# EAGLE design ImageProc (EAGLE 6.5.0)
AUTHOR: Ryan Julian (ryanjulian@berkeley.edu); DESIGN_NAME: ImageProc 2.5; REVISION: C; YEAR: 2012

## Sheet 1 of 5: Power
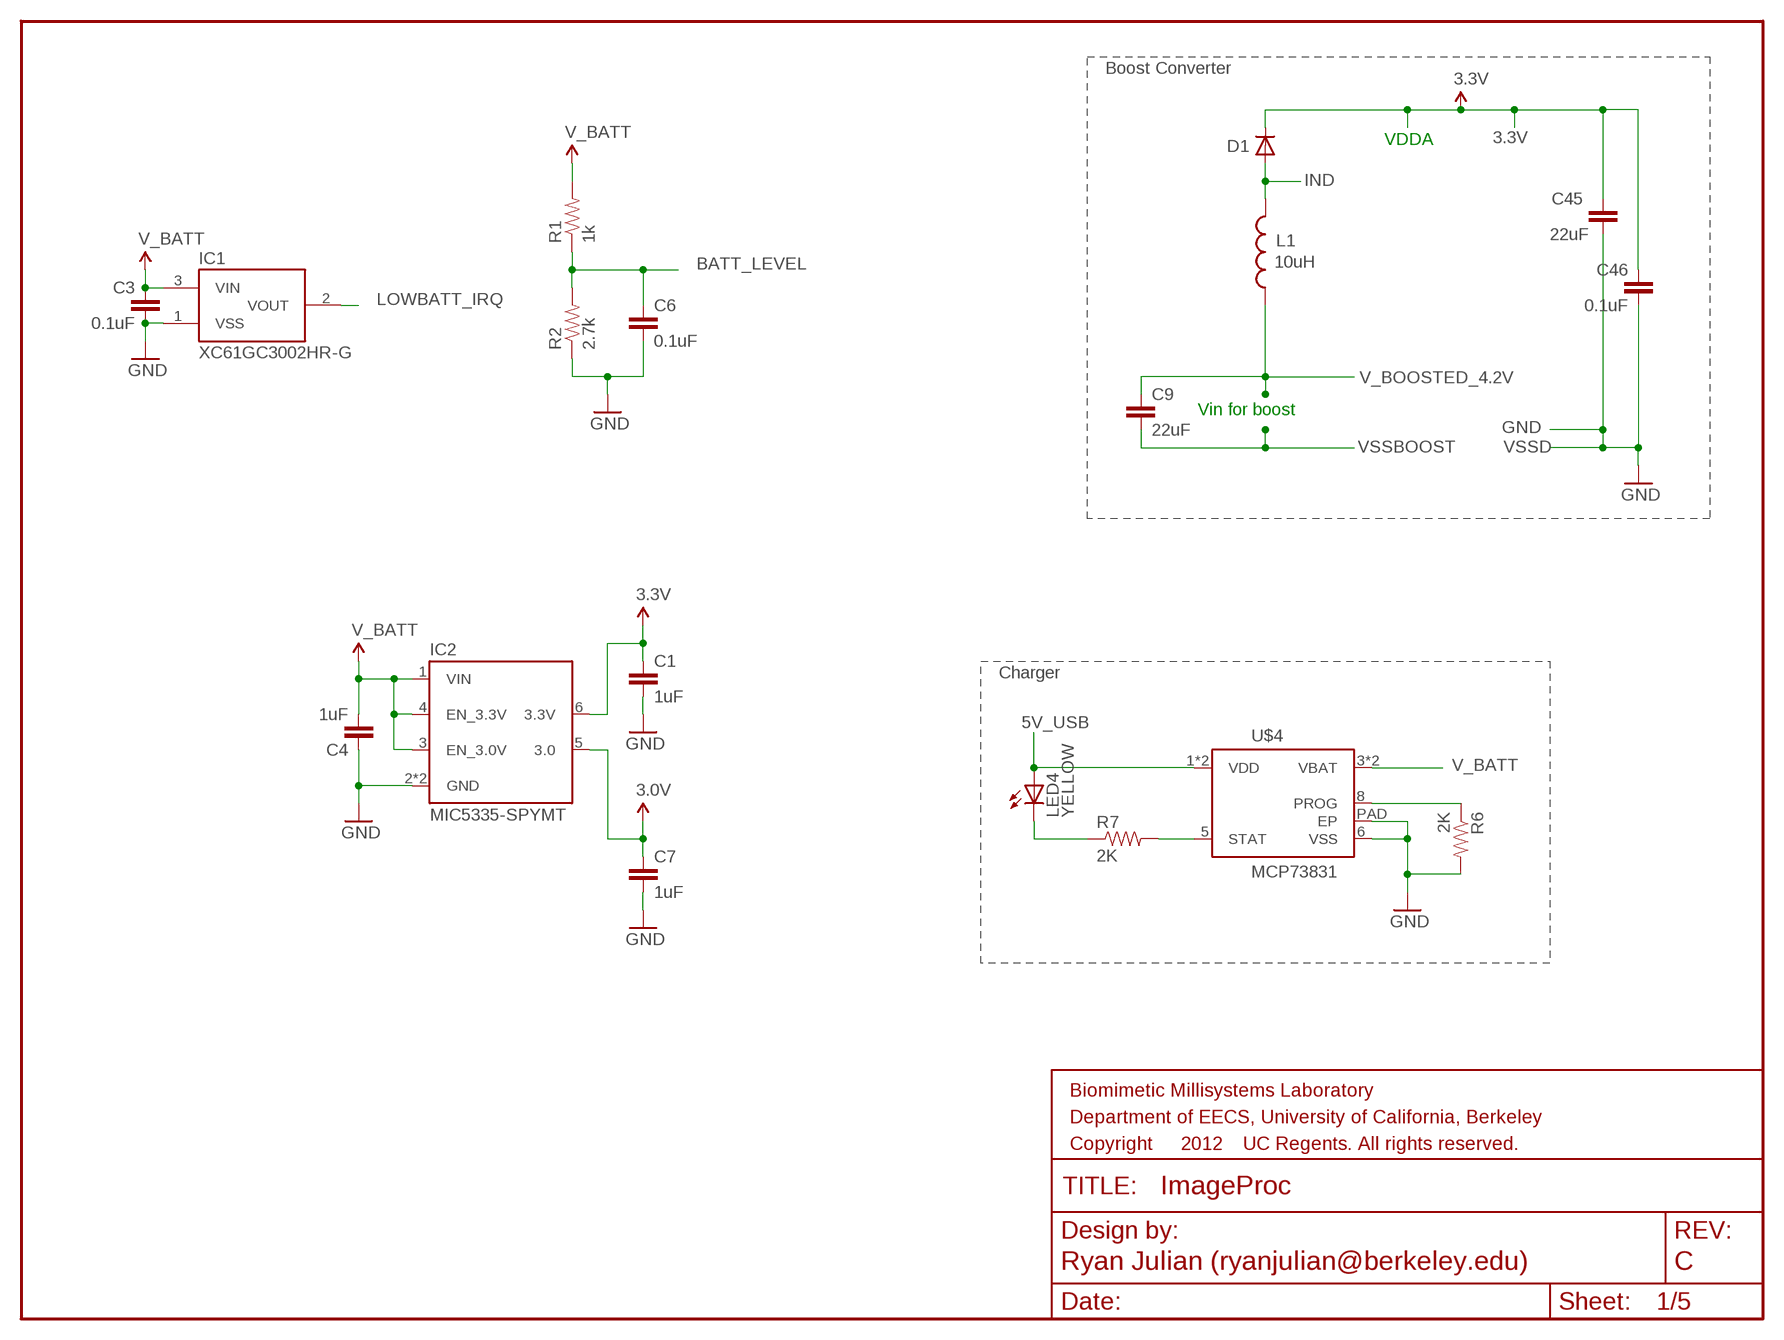
[diagram p0: schematic, sheet 1]
FRAME6 (FRAME-LETTER): SHEET_NAME: Power; YEAR: 2012

### Parts
C1  1uF  CAP0402-CAP  [0402-CAP]
C3  0.1uF  CAP0402-CAP  [0402-CAP]
C4  1uF  CAP0402-CAP  [0402-CAP]
C6  0.1uF  CAP0402-CAP  [0402-CAP]
C7  1uF  CAP0402-CAP  [0402-CAP]
C9  22uF  CAP0805  [0805]
C45  22uF  CAP0805  [0805]
C46  0.1uF  CAP0402-CAP  [0402-CAP]
D1  DIODE-SOD123  [SOD123]
IC1  XC61GC3002HR-G  [USP-3]
IC2  MIC5335-SPYMT  [MLF-6]
L1  10uH  SRN3015-100M  [INDUCTOR_SMD_3X3]
LED4  YELLOW  LED0603  [LED-0603]
R1  1k  RESISTOR0402-RES  [0402-RES]
R2  2.7k  RESISTOR0402-RES  [0402-RES]
R6  2K  RESISTOR0402-RES  [0402-RES]
R7  2K  RESISTOR0402-RES  [0402-RES]
U$4  MCP73831  [DFN-8]

### Nets
3.0V: C7.1 IC2.5(3.0)
3.3V: C1.1 C45.1 C46.1 D1.C IC2.6(3.3V) ; also sheet 2,3,4,5
5V_USB: LED4.A U$4.1(VDD) U$4.2(VDD) ; also sheet 5
BATT_LEVEL: C6.1 R1.1 R2.2 ; also sheet 2
GND: C1.2 C3.2 C4.1 C6.2 C7.2 C45.2 C46.2 IC1.1(VSS) IC2.2(GND) IC2.EPAD(GND) R2.1 R6.2 U$4.6(VSS) U$4.PAD(EP) ; also sheet 2,3,4,5
IND: D1.A L1.P$2 ; also sheet 2
LOWBATT_IRQ: IC1.2(VOUT) ; also sheet 2
N$5: R6.1 U$4.8(PROG)
N$11: LED4.C R7.1
N$21: R7.2 U$4.5(STAT)
V_BATT: C3.1 C4.2 IC1.3(VIN) IC2.1(VIN) IC2.3(EN_3.0V) IC2.4(EN_3.3V) R1.2 U$4.3(VBAT) U$4.4(VBAT) ; also sheet 4,5
V_BOOSTED_4.2V: C9.1 L1.P$1 ; also sheet 2
VSSBOOST: C9.2 ; also sheet 2

### Notes on the sheet
- Boost Converter
- VDDA
- Vin for boost
- VSSD
- Charger

## Sheet 2 of 5: Microcontroller
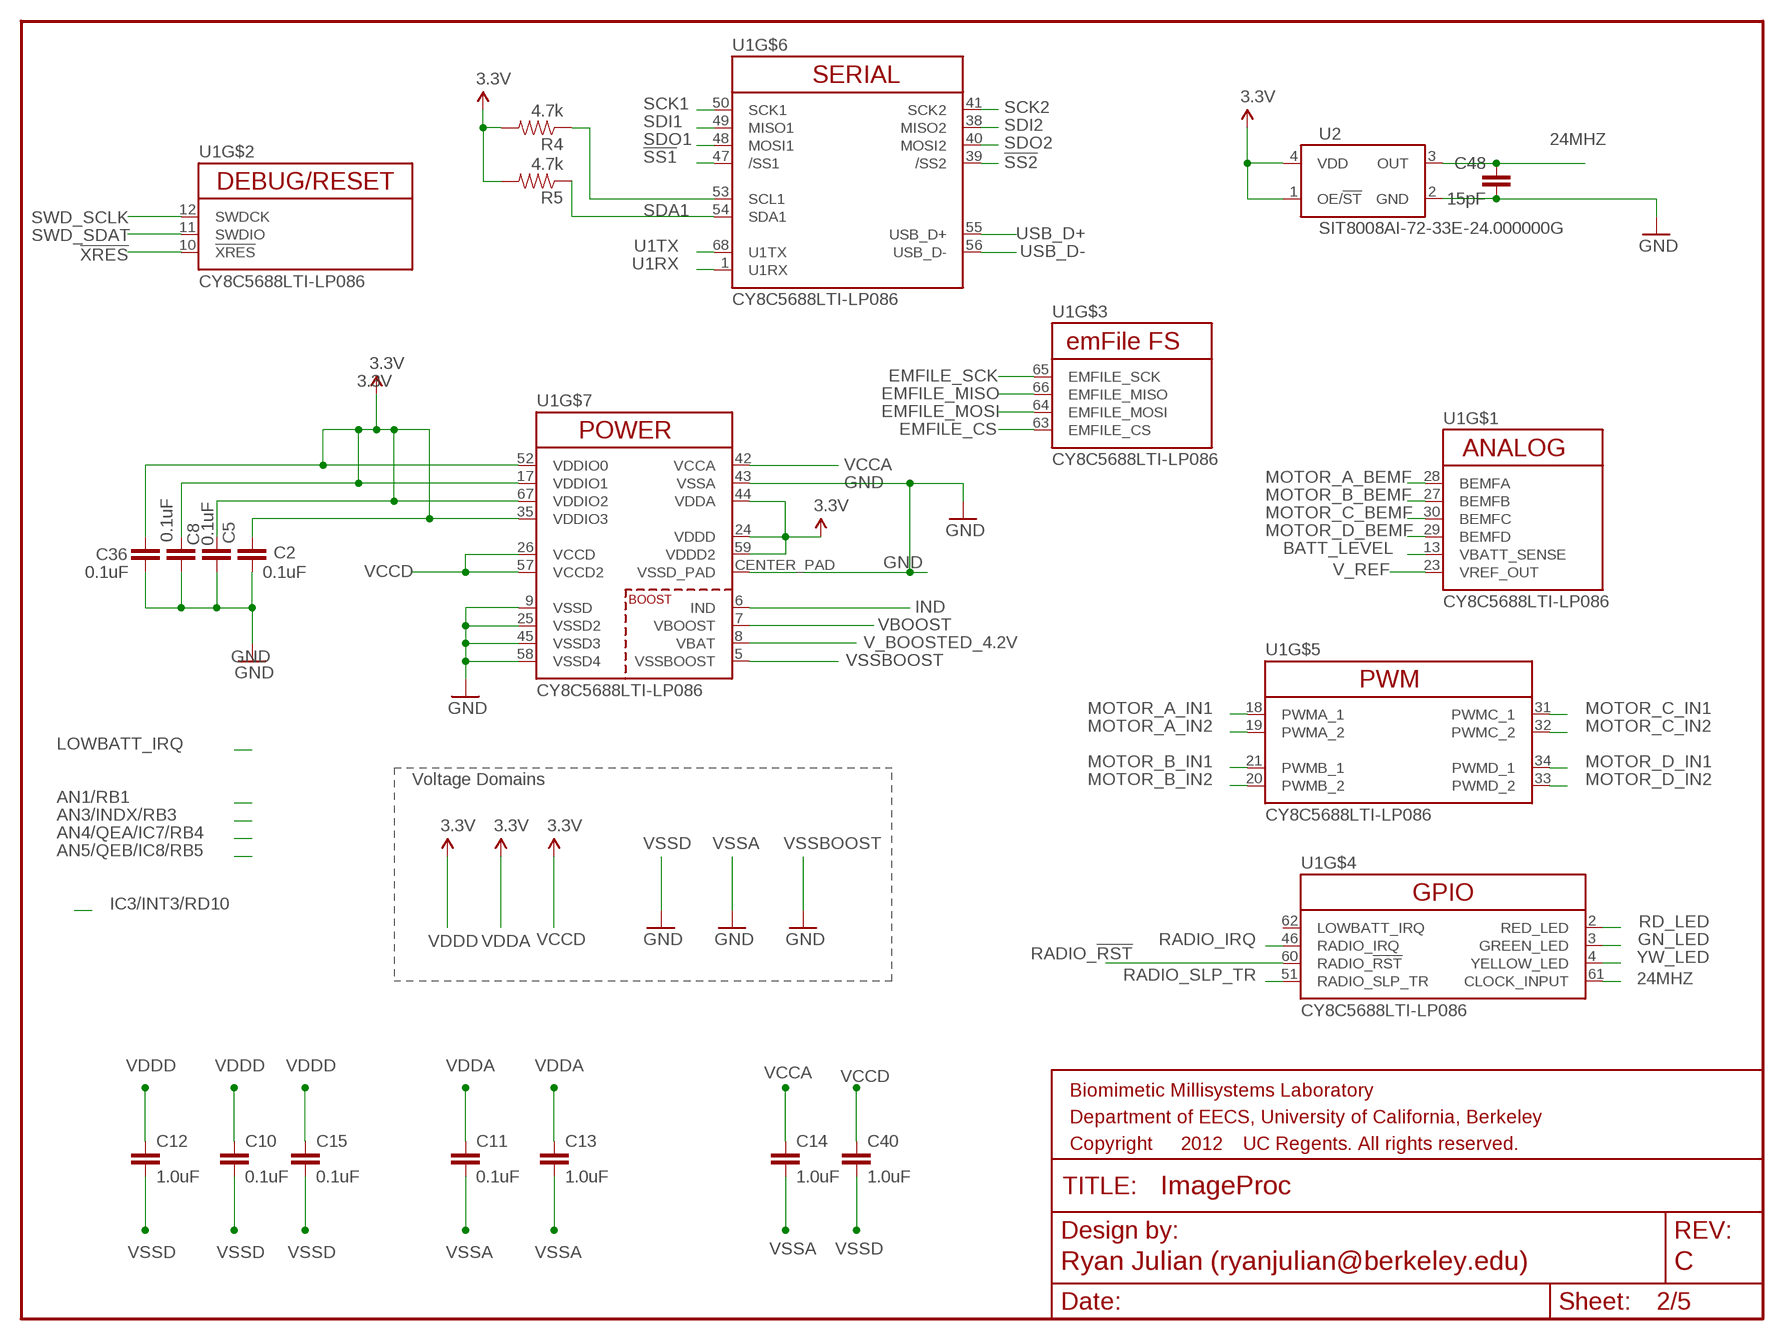
[diagram p1: schematic, sheet 2]
FRAME2 (FRAME-LETTER): SHEET_NAME: Microcontroller

### Parts
C2  0.1uF  CAP0402-CAP  [0402-CAP]
C5  0.1uF  CAP0402-CAP  [0402-CAP]
C8  0.1uF  CAP0402-CAP  [0402-CAP]
C10  0.1uF  CAP0402-CAP  [0402-CAP]
C11  0.1uF  CAP0402-CAP  [0402-CAP]
C12  1.0uF  CAP0402-CAP  [0402-CAP]
C13  1.0uF  CAP0402-CAP  [0402-CAP]
C14  1.0uF  CAP0402-CAP  [0402-CAP]
C15  0.1uF  CAP0402-CAP  [0402-CAP]
C36  0.1uF  CAP0402-CAP  [0402-CAP]
C40  1.0uF  CAP0402-CAP  [0402-CAP]
C48  15pF  CAP0402-CAP  [0402-CAP]
R4  4.7k  RESISTOR0402-RES  [0402-RES]
R5  4.7k  RESISTOR0402-RES  [0402-RES]
U1  CY8C5688LTI-LP086  [68QFN]
U2  SIT8008AI-72-33E-24.000000G  [4-SMD]

### Nets
3.3V: C2.1 C5.1 C8.1 C10.1 C11.1 C12.1 C13.1 C15.1 C36.1 R4.2 R5.2 U1.17(VDDIO1) U1.24(VDDD) U1.35(VDDIO3) U1.44(VDDA) U1.52(VDDIO0) U1.59(VDDD2) U1.67(VDDIO2) U2.1(OE/!ST) U2.4(VDD) ; also sheet 1,3,4,5
24MHZ: C48.1 U1.61(CLOCK_INPUT) U2.3(OUT)
!SS1: U1.47(/SS1) ; also sheet 3
!SS2: U1.39(/SS2) ; also sheet 5
!XRES: U1.10(!XRES) ; also sheet 5
BATT_LEVEL: U1.13(VBATT_SENSE) ; also sheet 1
EMFILE_CS: U1.63(EMFILE_CS) ; also sheet 5
EMFILE_MISO: U1.66(EMFILE_MISO) ; also sheet 5
EMFILE_MOSI: U1.64(EMFILE_MOSI) ; also sheet 5
EMFILE_SCK: U1.65(EMFILE_SCK) ; also sheet 5
GN_LED: U1.3(GREEN_LED) ; also sheet 5
GND: C2.2 C5.2 C8.2 C10.2 C11.2 C12.2 C14.2 C15.2 C36.2 C40.2 C48.2 U1.9(VSSD) U1.25(VSSD2) U1.43(VSSA) U1.45(VSSD3) U1.58(VSSD4) U1.CENTER_PAD(VSSD_PAD) U2.2(GND) ; also sheet 1,3,4,5
IND: U1.6(IND) ; also sheet 1
MOTOR_A_BEMF: U1.28(BEMFA) ; also sheet 4
MOTOR_A_IN1: U1.18(PWMA_1) ; also sheet 4
MOTOR_A_IN2: U1.19(PWMA_2) ; also sheet 4
MOTOR_B_BEMF: U1.27(BEMFB) ; also sheet 4
MOTOR_B_IN1: U1.21(PWMB_1) ; also sheet 4
MOTOR_B_IN2: U1.20(PWMB_2) ; also sheet 4
MOTOR_C_BEMF: U1.30(BEMFC) ; also sheet 4
MOTOR_C_IN1: U1.31(PWMC_1) ; also sheet 4
MOTOR_C_IN2: U1.32(PWMC_2) ; also sheet 4
MOTOR_D_BEMF: U1.29(BEMFD) ; also sheet 4
MOTOR_D_IN1: U1.34(PWMD_1) ; also sheet 4
MOTOR_D_IN2: U1.33(PWMD_2) ; also sheet 4
RADIO_!RST: U1.60(RADIO_!RST) ; also sheet 3
RADIO_IRQ: U1.46(RADIO_IRQ) ; also sheet 3
RADIO_SLP_TR: U1.51(RADIO_SLP_TR) ; also sheet 3
RD_LED: U1.2(RED_LED) ; also sheet 5
SCK1: U1.50(SCK1) ; also sheet 3
SCK2: U1.41(SCK2) ; also sheet 5
SCL1: R4.1 U1.53(SCL1) ; also sheet 5
SDA1: R5.1 U1.54(SDA1) ; also sheet 5
SDI1: U1.49(MISO1) ; also sheet 3
SDI2: U1.38(MISO2) ; also sheet 5
SDO1: U1.48(MOSI1) ; also sheet 3
SDO2: U1.40(MOSI2) ; also sheet 5
SWD_SCLK: U1.12(SWDCK) ; also sheet 5
SWD_SDAT: U1.11(SWDIO) ; also sheet 5
U1RX: U1.1(U1RX) ; also sheet 5
U1TX: U1.68(U1TX) ; also sheet 5
USB_D+: U1.55(USB_D+) ; also sheet 5
USB_D-: U1.56(USB_D-) ; also sheet 5
V_BOOSTED_4.2V: U1.8(VBAT) ; also sheet 1
V_REF: U1.23(VREF_OUT) ; also sheet 4
VBOOST: U1.7(VBOOST)
VCCA: C14.1 U1.42(VCCA)
VCCD: C40.1 U1.26(VCCD) U1.57(VCCD2)
VSSA: C13.2
VSSBOOST: U1.5(VSSBOOST) ; also sheet 1
YW_LED: U1.4(YELLOW_LED) ; also sheet 5
Unconnected: U1.62(LOWBATT_IRQ)

### Notes on the sheet
- Voltage Domains
- VSSD | VSSA | VSSBOOST
- VDDD | VDDA | VCCD
- VDDD | VDDD | VDDD | VDDA | VDDA
- VCCA
- VSSD | VSSD | VSSD | VSSA | VSSA | VSSA | VSSD

## Sheet 3 of 5: Radio
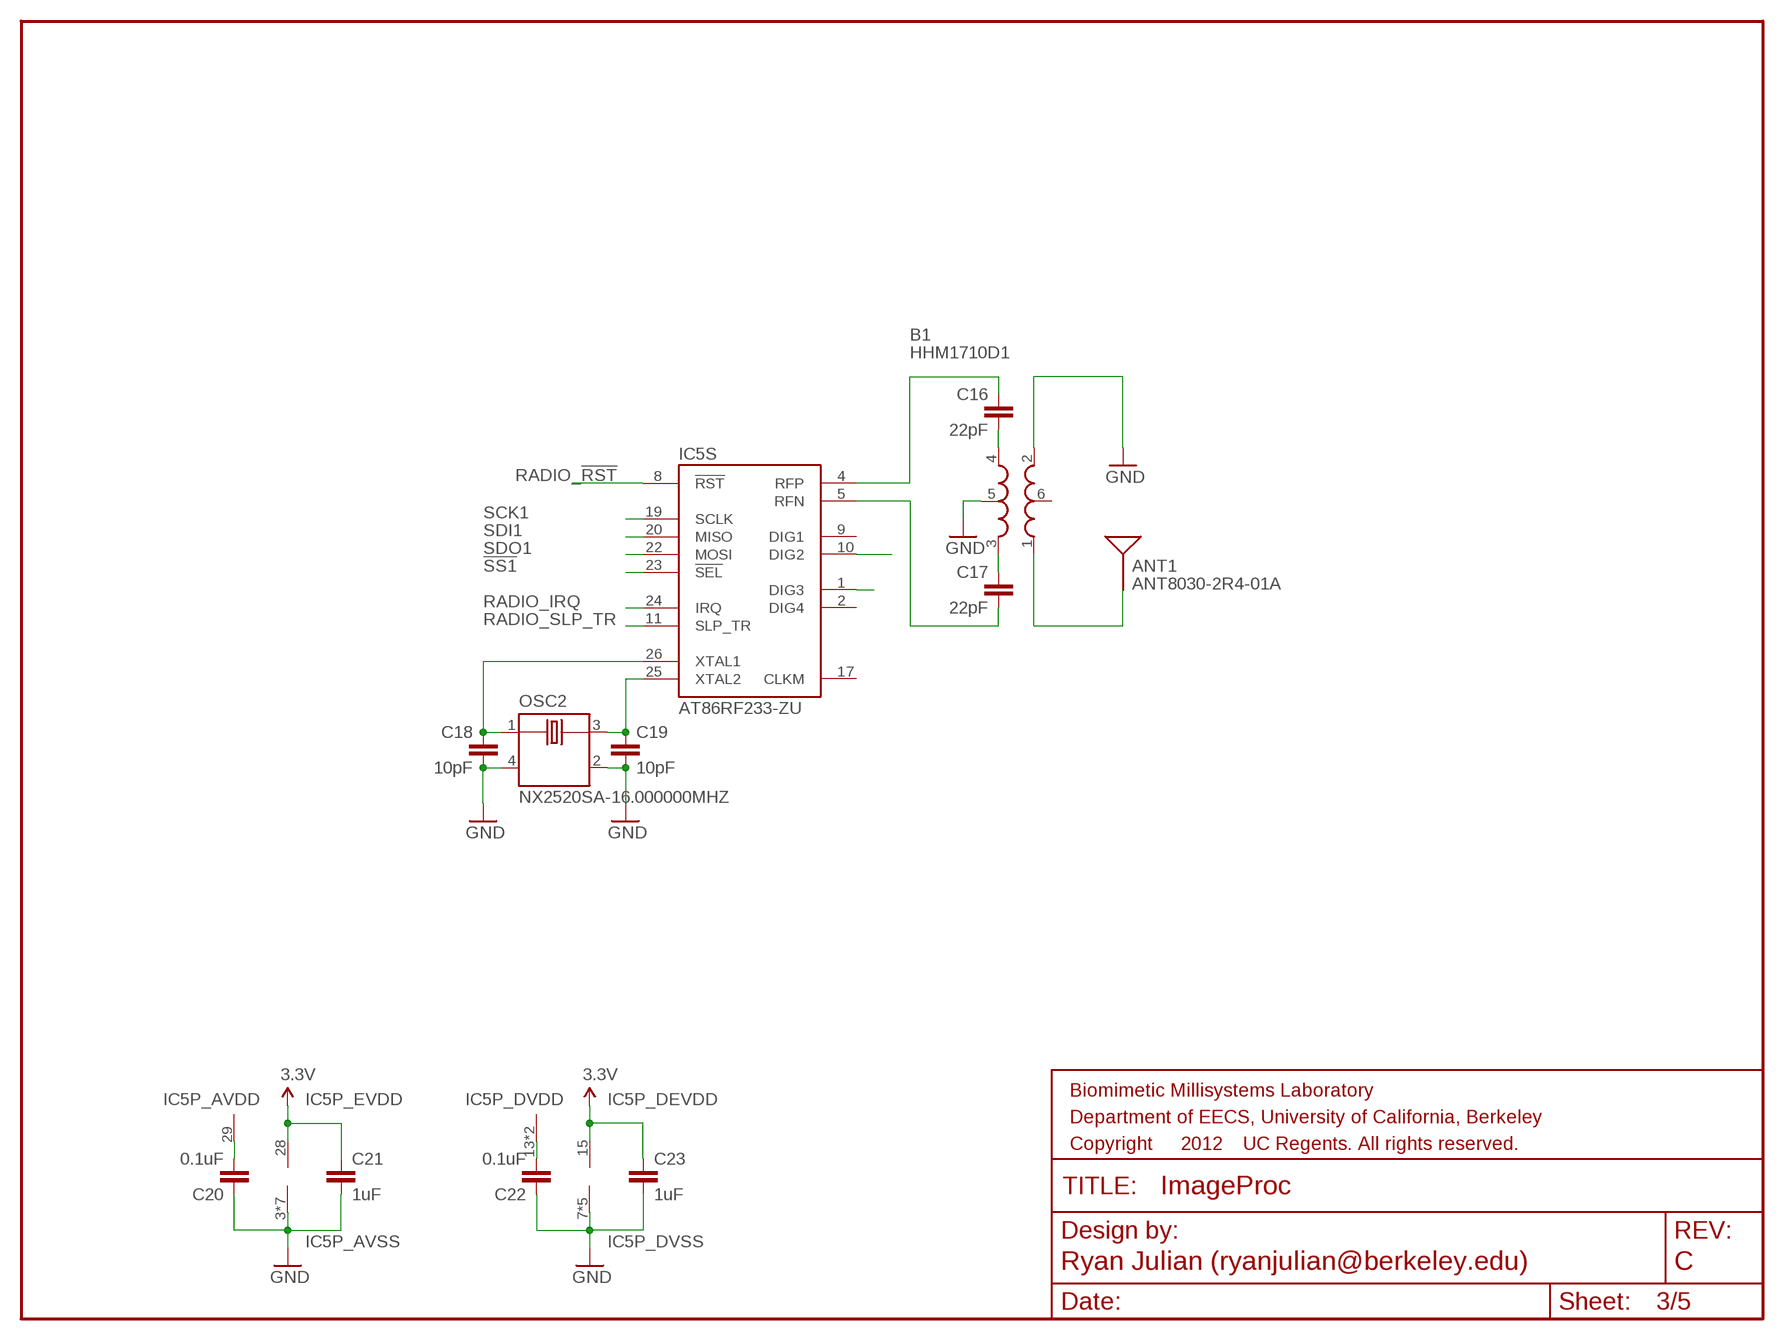
[diagram p2: schematic, sheet 3]
FRAME1 (FRAME-LETTER): SHEET_NAME: Radio

### Parts
ANT1  ANT8030-2R4-01A  [ANT8030-2R4-01A]
B1  HHM1710D1  [0603-BALUN]
C16  22pF  CAP0402-CAP  [0402-CAP]
C17  22pF  CAP0402-CAP  [0402-CAP]
C18  10pF  CAP0402-CAP  [0402-CAP]
C19  10pF  CAP0402-CAP  [0402-CAP]
C20  0.1uF  CAP0402-CAP  [0402-CAP]
C21  1uF  CAP0402-CAP  [0402-CAP]
C22  0.1uF  CAP0402-CAP  [0402-CAP]
C23  1uF  CAP0402-CAP  [0402-CAP]
IC5  AT86RF233-ZU  [VQFN-32QN2]
OSC2  NX2520SA-16.000000MHZ  [CRYSTAL-SMD]

### Nets
3.3V: C21.1 C23.1 IC5.15(P_DEVDD:V+) IC5.28(P_EVDD:V+) ; also sheet 1,2,4,5
!SS1: IC5.23(S:!SEL) ; also sheet 2
GND: B1.2(RFGND) B1.5(GND) C18.2 C19.2 C20.1 C21.2 C22.1 C23.2 IC5.3(P_AVSS:V-) IC5.6(P_AVSS:V-) IC5.7(P_DVSS:V-) IC5.12(P_DVSS:V-) IC5.16(P_DVSS:V-) IC5.18(P_DVSS:V-) IC5.21(P_DVSS:V-) IC5.27(P_AVSS:V-) IC5.30(P_AVSS:V-) IC5.31(P_AVSS:V-) IC5.32(P_AVSS:V-) IC5.PAD(P_AVSS:V-) OSC2.2(GND) OSC2.4(GND) ; also sheet 1,2,4,5
N$1: C22.2 IC5.13(P_DVDD:V+) IC5.14(P_DVDD:V+)
N$3: C20.2 IC5.29(P_AVDD:V+)
N$4: ANT1.A(SIGNAL) B1.1(UNBAL)
N$6: C16.1 IC5.4(S:RFP)
N$7: C17.2 IC5.5(S:RFN)
N$8: C19.1 IC5.25(S:XTAL2) OSC2.3(OUT/IN)
N$9: C18.1 IC5.26(S:XTAL1) OSC2.1(IN/OUT)
N$10: B1.3(BAL3) C17.1
N$12: B1.4(BAL4) C16.2
N$13: IC5.1(S:DIG3)
N$14: IC5.10(S:DIG2)
RADIO_!RST: IC5.8(S:!RST) ; also sheet 2
RADIO_IRQ: IC5.24(S:IRQ) ; also sheet 2
RADIO_SLP_TR: IC5.11(S:SLP_TR) ; also sheet 2
SCK1: IC5.19(S:SCLK) ; also sheet 2
SDI1: IC5.20(S:MISO) ; also sheet 2
SDO1: IC5.22(S:MOSI) ; also sheet 2
Unconnected: B1.6(NC) IC5.2(S:DIG4) IC5.9(S:DIG1) IC5.17(S:CLKM)

## Sheet 4 of 5: Motor Control
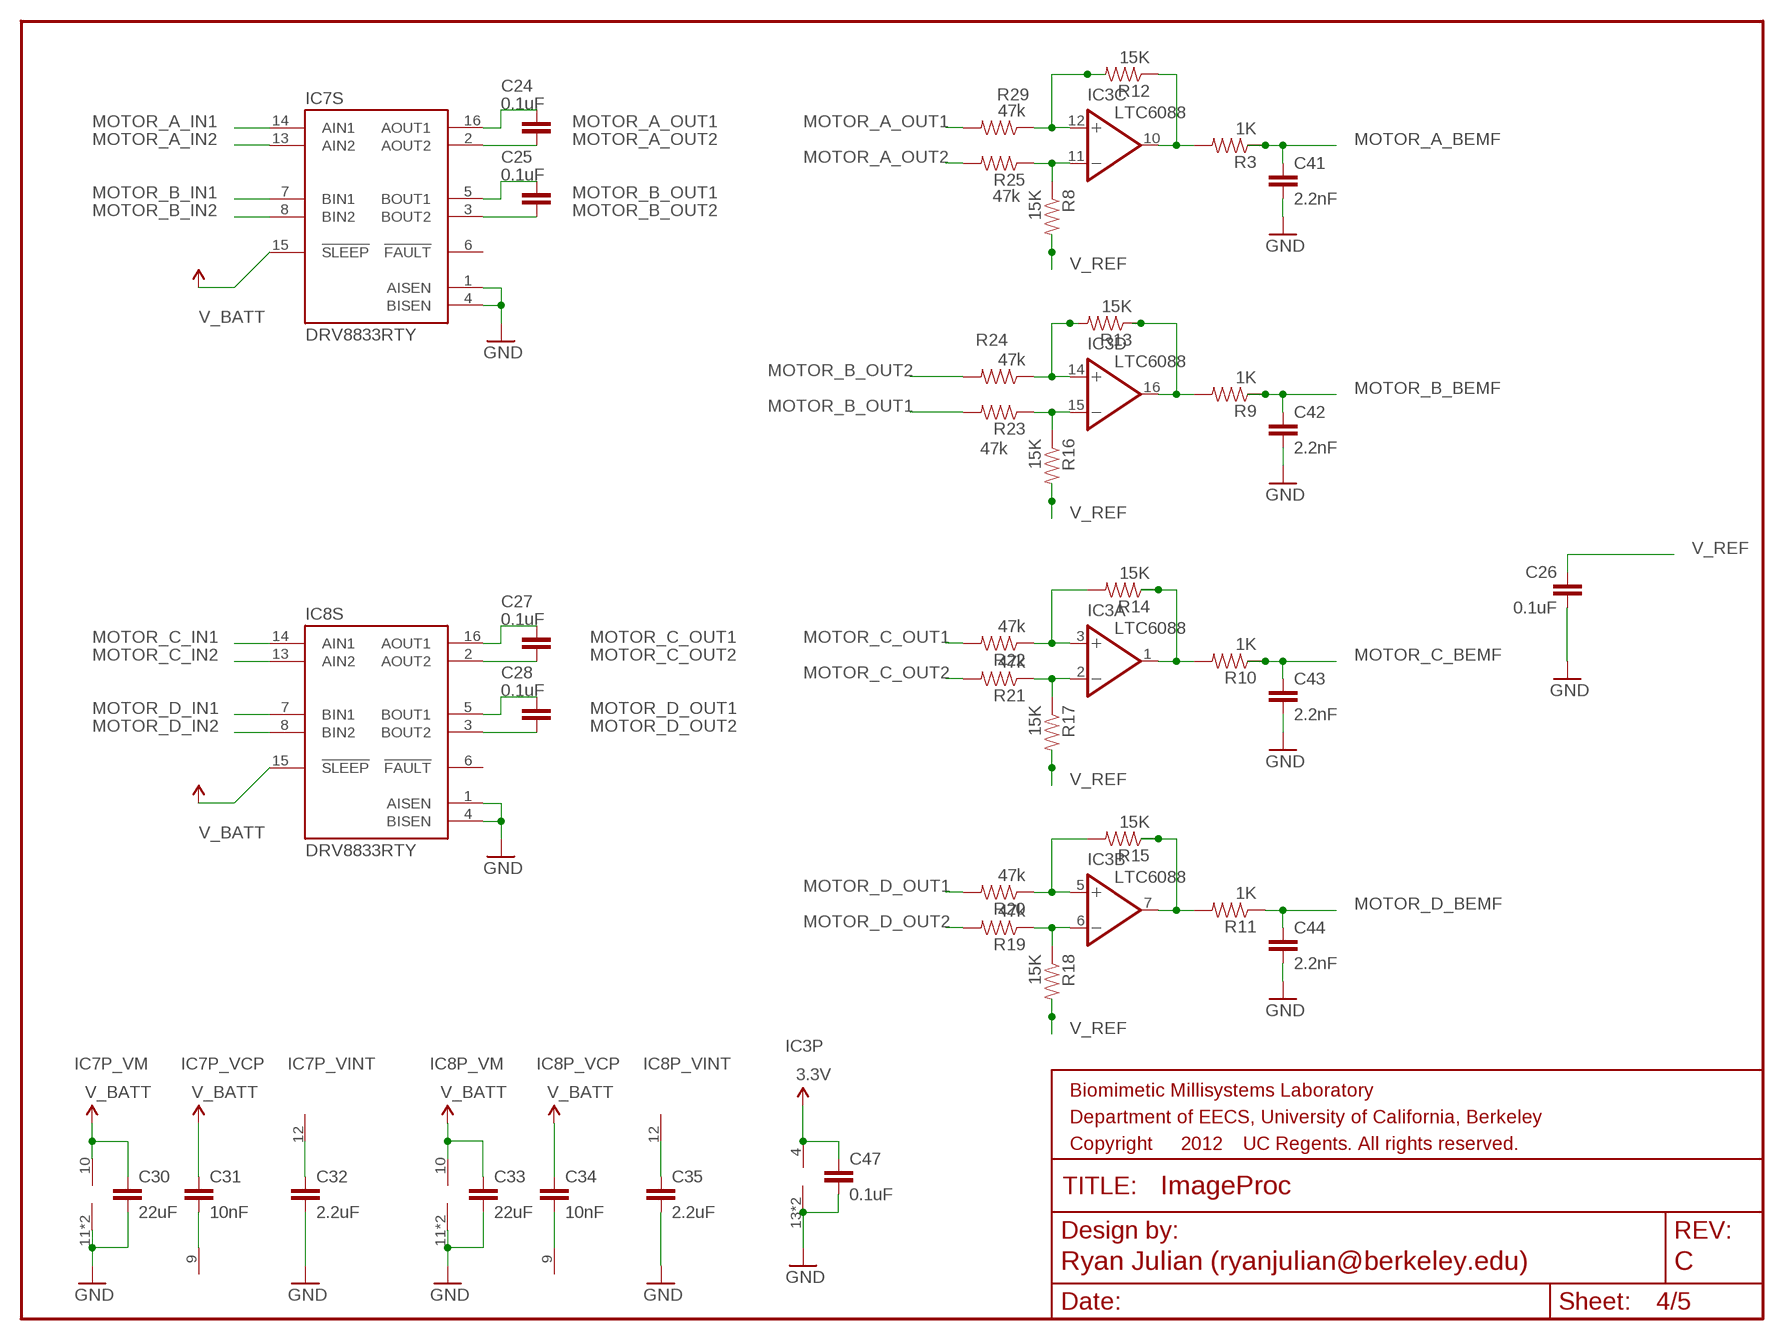
[diagram p3: schematic, sheet 4]
FRAME3 (FRAME-LETTER): SHEET_NAME: Motor Control

### Parts
C24  0.1uF  CAP0402-CAP  [0402-CAP]
C25  0.1uF  CAP0402-CAP  [0402-CAP]
C26  0.1uF  CAP0402-CAP  [0402-CAP]
C27  0.1uF  CAP0402-CAP  [0402-CAP]
C28  0.1uF  CAP0402-CAP  [0402-CAP]
C30  22uF  CAP0603-CAP  [0603-CAP]
C31  10nF  CAP0402-CAP  [0402-CAP]
C32  2.2uF  CAP0402-CAP  [0402-CAP]
C33  22uF  CAP0603-CAP  [0603-CAP]
C34  10nF  CAP0402-CAP  [0402-CAP]
C35  2.2uF  CAP0402-CAP  [0402-CAP]
C41  2.2nF  CAP0402-CAP  [0402-CAP]
C42  2.2nF  CAP0402-CAP  [0402-CAP]
C43  2.2nF  CAP0402-CAP  [0402-CAP]
C44  2.2nF  CAP0402-CAP  [0402-CAP]
C47  0.1uF  CAP0402-CAP  [0402-CAP]
IC3  LTC6088  [DFN-16]
IC7  DRV8833RTY  [S-PWQFN-N16]
IC8  DRV8833RTY  [S-PWQFN-N16]
R3  1K  RESISTOR0402-RES  [0402-RES]
R8  15K  RESISTOR0402-RES  [0402-RES]
R9  1K  RESISTOR0402-RES  [0402-RES]
R10  1K  RESISTOR0402-RES  [0402-RES]
R11  1K  RESISTOR0402-RES  [0402-RES]
R12  15K  RESISTOR0402-RES  [0402-RES]
R13  15K  RESISTOR0402-RES  [0402-RES]
R14  15K  RESISTOR0402-RES  [0402-RES]
R15  15K  RESISTOR0402-RES  [0402-RES]
R16  15K  RESISTOR0402-RES  [0402-RES]
R17  15K  RESISTOR0402-RES  [0402-RES]
R18  15K  RESISTOR0402-RES  [0402-RES]
R19  47k  RESISTOR0402-RES  [0402-RES]
R20  47k  RESISTOR0402-RES  [0402-RES]
R21  47k  RESISTOR0402-RES  [0402-RES]
R22  47k  RESISTOR0402-RES  [0402-RES]
R23  47k  RESISTOR0402-RES  [0402-RES]
R24  47k  RESISTOR0402-RES  [0402-RES]
R25  47k  RESISTOR0402-RES  [0402-RES]
R29  47k  RESISTOR0402-RES  [0402-RES]

### Nets
3.3V: C47.1 IC3.4(P:V+) ; also sheet 1,2,3,5
GND: C26.2 C30.2 C32.2 C33.2 C35.2 C41.2 C42.2 C43.2 C44.2 C47.2 IC3.13(P:V-) IC3.PAD(P:V-) IC7.1(S:AISEN) IC7.4(S:BISEN) IC7.11(P_VM:V-) IC7.PPAD(P_VM:V-) IC8.1(S:AISEN) IC8.4(S:BISEN) IC8.11(P_VM:V-) IC8.PPAD(P_VM:V-) ; also sheet 1,2,3,5
MOTOR_A_BEMF: C41.1 R3.1 ; also sheet 2
MOTOR_A_IN1: IC7.14(S:AIN1) ; also sheet 2
MOTOR_A_IN2: IC7.13(S:AIN2) ; also sheet 2
MOTOR_A_OUT1: C24.1 IC7.16(S:AOUT1) R29.2 ; also sheet 5
MOTOR_A_OUT2: C24.2 IC7.2(S:AOUT2) R25.2 ; also sheet 5
MOTOR_B_BEMF: C42.1 R9.1 ; also sheet 2
MOTOR_B_IN1: IC7.7(S:BIN1) ; also sheet 2
MOTOR_B_IN2: IC7.8(S:BIN2) ; also sheet 2
MOTOR_B_OUT1: C25.1 IC7.5(S:BOUT1) R23.2 ; also sheet 5
MOTOR_B_OUT2: C25.2 IC7.3(S:BOUT2) R24.2 ; also sheet 5
MOTOR_C_BEMF: C43.1 R10.1 ; also sheet 2
MOTOR_C_IN1: IC8.14(S:AIN1) ; also sheet 2
MOTOR_C_IN2: IC8.13(S:AIN2) ; also sheet 2
MOTOR_C_OUT1: C27.1 IC8.16(S:AOUT1) R22.2 ; also sheet 5
MOTOR_C_OUT2: C27.2 IC8.2(S:AOUT2) R21.2 ; also sheet 5
MOTOR_D_BEMF: C44.1 R11.1 ; also sheet 2
MOTOR_D_IN1: IC8.7(S:BIN1) ; also sheet 2
MOTOR_D_IN2: IC8.8(S:BIN2) ; also sheet 2
MOTOR_D_OUT1: C28.1 IC8.5(S:BOUT1) R20.2 ; also sheet 5
MOTOR_D_OUT2: C28.2 IC8.3(S:BOUT2) R19.2 ; also sheet 5
N$2: C31.2 IC7.9(P_VCP:V+)
N$18: C32.1 IC7.12(P_VINT:V-)
N$19: C34.2 IC8.9(P_VCP:V+)
N$20: C35.1 IC8.12(P_VINT:V-)
N$22: IC3.14(D:+IN) R13.2 R24.1
N$23: IC3.15(D:-IN) R16.1 R23.1
N$24: IC3.3(A:+IN) R14.2 R22.1
N$25: IC3.2(A:-IN) R17.1 R21.1
N$26: IC3.5(B:+IN) R15.2 R20.1
N$27: IC3.6(B:-IN) R18.1 R19.1
N$30: IC3.12(C:+IN) R12.2 R29.1
N$31: IC3.11(C:-IN) R8.1 R25.1
N$34: IC3.7(B:OUT) R11.2 R15.1
N$35: IC3.1(A:OUT) R10.2 R14.1
N$36: IC3.10(C:OUT) R3.2 R12.1
N$37: IC3.16(D:OUT) R9.2 R13.1
V_BATT: C30.1 C31.1 C33.1 C34.1 IC7.10(P_VM:V+) IC7.15(S:!SLEEP) IC8.10(P_VM:V+) IC8.15(S:!SLEEP) ; also sheet 1,5
V_REF: C26.1 R8.2 R16.2 R17.2 R18.2 ; also sheet 2
Unconnected: IC7.6(S:!FAULT) IC8.6(S:!FAULT)

## Sheet 5 of 5: Connectors and Peripherals
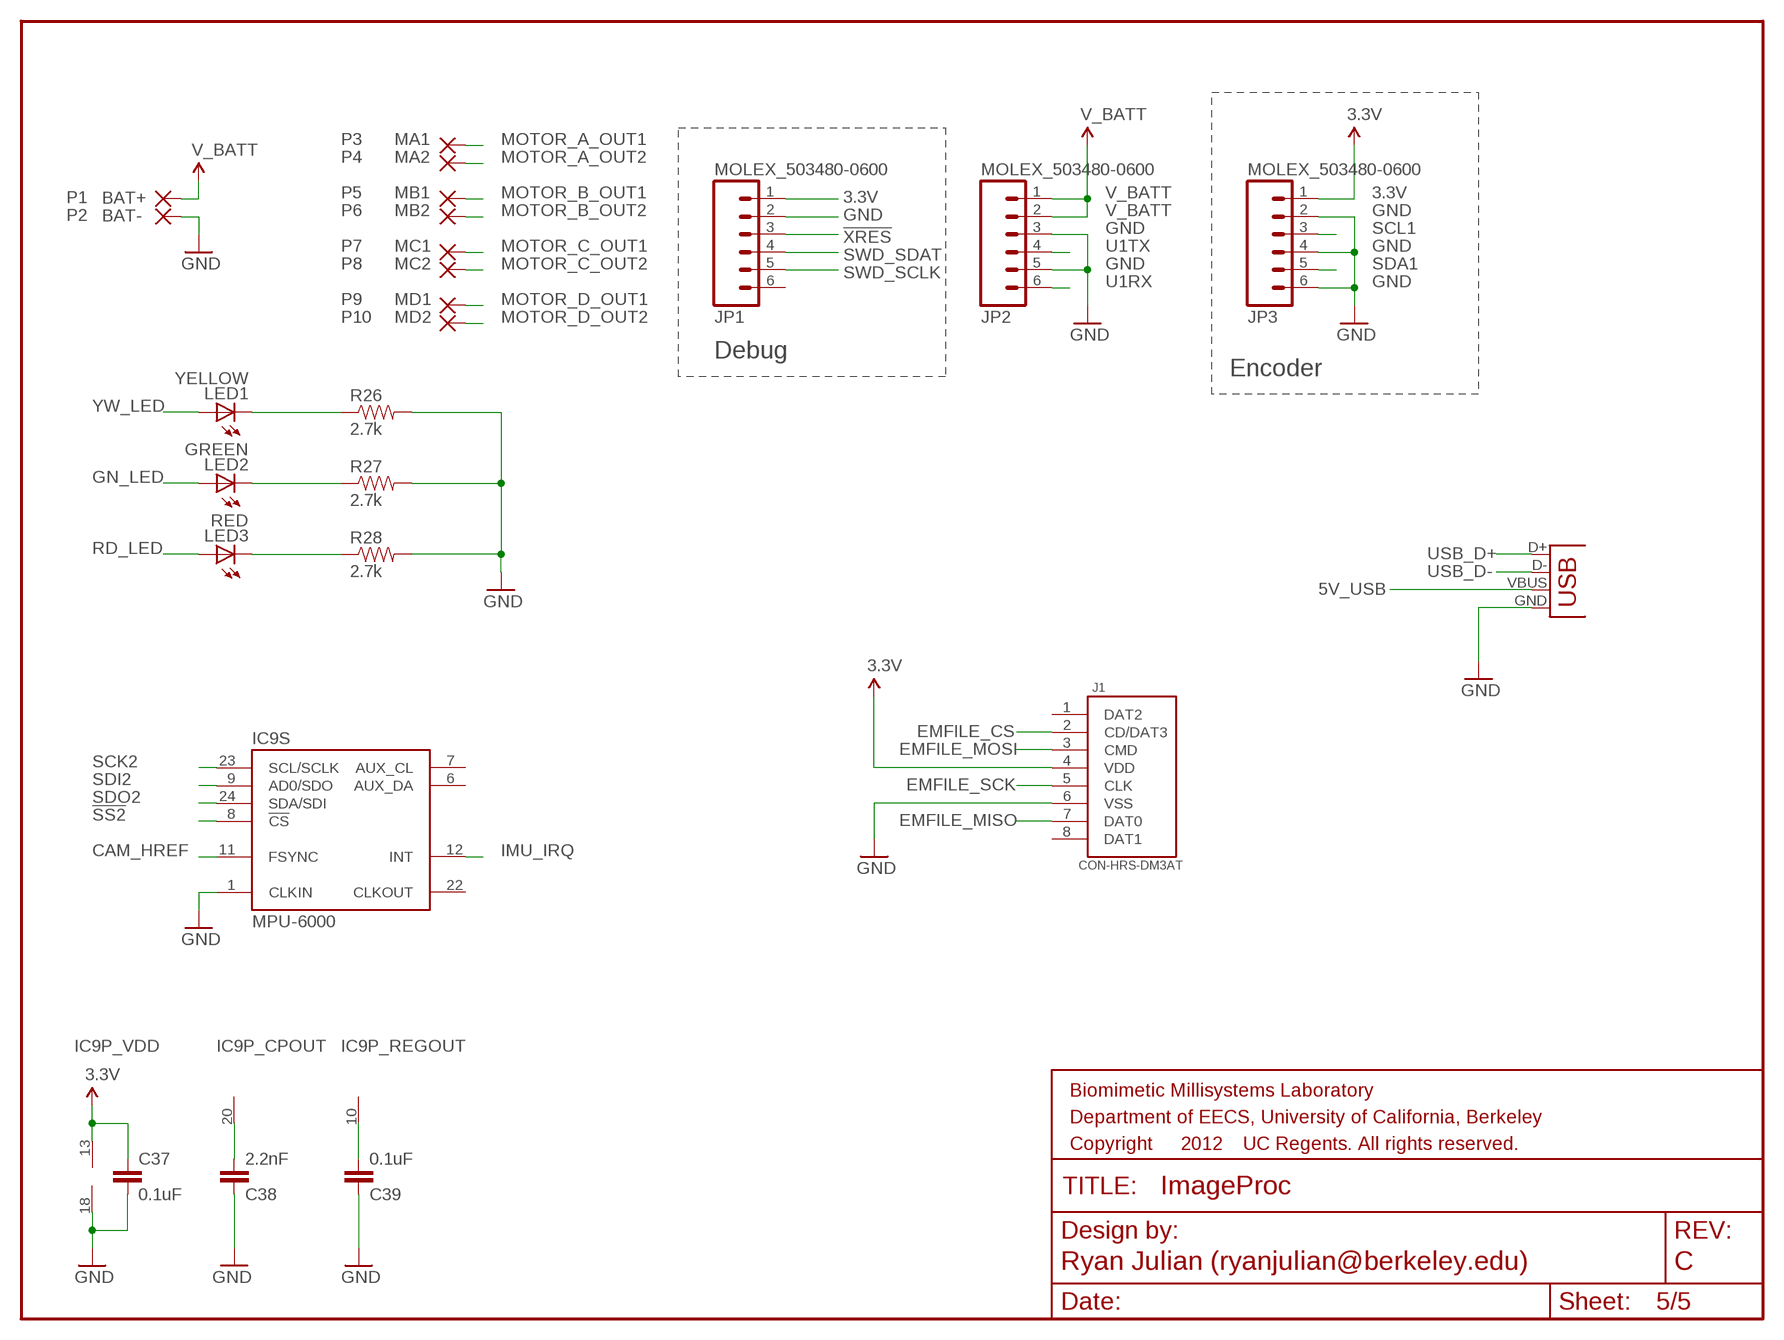
[diagram p4: schematic, sheet 5]
FRAME5 (FRAME-LETTER): SHEET_NAME: Connectors and Peripherals

### Parts
C37  0.1uF  CAP0402-CAP  [0402-CAP]
C38  2.2nF  CAP0402-CAP  [0402-CAP]
C39  0.1uF  CAP0402-CAP  [0402-CAP]
IC9  MPU-6000  [QFN-24]
J1  CON-HRS-DM3AT  [HRS-DM3AT]
JP1  MOLEX_503480-0600  [MOLEX_503480-0600]
JP2  MOLEX_503480-0600  [MOLEX_503480-0600]
JP3  MOLEX_503480-0600  [MOLEX_503480-0600]
JP6  USBSMD  [USB-MINIB]
LED1  YELLOW  LED0603  [LED-0603]
LED2  GREEN  LED0603  [LED-0603]
LED3  RED  LED0603  [LED-0603]
P1  BAT+  SMD2  [SMD1,27-2,54]
P2  BAT-  SMD2  [SMD1,27-2,54]
P3  MA1  SMD2  [SMD1,27-2,54]
P4  MA2  SMD2  [SMD1,27-2,54]
P5  MB1  SMD2  [SMD1,27-2,54]
P6  MB2  SMD2  [SMD1,27-2,54]
P7  MC1  SMD2  [SMD1,27-2,54]
P8  MC2  SMD2  [SMD1,27-2,54]
P9  MD1  SMD2  [SMD1,27-2,54]
P10  MD2  SMD2  [SMD1,27-2,54]
R26  2.7k  RESISTOR0402-RES  [0402-RES]
R27  2.7k  RESISTOR0402-RES  [0402-RES]
R28  2.7k  RESISTOR0402-RES  [0402-RES]

### Nets
3.3V: C37.1 IC9.13(P_VDD:V+) J1.4(VDD) JP1.1 JP3.1 ; also sheet 1,2,3,4
5V_USB: JP6.VBUS ; also sheet 1
!SS2: IC9.8(S:!CS) ; also sheet 2
!XRES: JP1.3 ; also sheet 2
CAM_HREF: IC9.11(S:FSYNC)
EMFILE_CS: J1.2(CD/DAT3) ; also sheet 2
EMFILE_MISO: J1.7(DAT0) ; also sheet 2
EMFILE_MOSI: J1.3(CMD) ; also sheet 2
EMFILE_SCK: J1.5(CLK) ; also sheet 2
GN_LED: LED2.A ; also sheet 2
GND: C37.2 C38.1 C39.1 IC9.1(S:CLKIN) IC9.18(P_VDD:V-) J1.6(VSS) JP1.2 JP2.3 JP2.5 JP3.2 JP3.4 JP3.6 JP6.GND P2.1(P) R26.2 R27.2 R28.2 ; also sheet 1,2,3,4
IMU_IRQ: IC9.12(S:INT)
MOTOR_A_OUT1: P3.1(P) ; also sheet 4
MOTOR_A_OUT2: P4.1(P) ; also sheet 4
MOTOR_B_OUT1: P5.1(P) ; also sheet 4
MOTOR_B_OUT2: P6.1(P) ; also sheet 4
MOTOR_C_OUT1: P7.1(P) ; also sheet 4
MOTOR_C_OUT2: P8.1(P) ; also sheet 4
MOTOR_D_OUT1: P9.1(P) ; also sheet 4
MOTOR_D_OUT2: P10.1(P) ; also sheet 4
N$15: LED1.C R26.1
N$16: LED2.C R27.1
N$17: LED3.C R28.1
N$29: C38.2 IC9.20(P_CPOUT:V-)
N$32: C39.2 IC9.10(P_REGOUT:V-)
RD_LED: LED3.A ; also sheet 2
SCK2: IC9.23(S:SCL/SCLK) ; also sheet 2
SCL1: JP3.3 ; also sheet 2
SDA1: JP3.5 ; also sheet 2
SDI2: IC9.9(S:AD0/SDO) ; also sheet 2
SDO2: IC9.24(S:SDA/SDI) ; also sheet 2
SWD_SCLK: JP1.5 ; also sheet 2
SWD_SDAT: JP1.4 ; also sheet 2
U1RX: JP2.6 ; also sheet 2
U1TX: JP2.4 ; also sheet 2
USB_D+: JP6.D+ ; also sheet 2
USB_D-: JP6.D- ; also sheet 2
V_BATT: JP2.1 JP2.2 P1.1(P) ; also sheet 1,4
YW_LED: LED1.A ; also sheet 2
Unconnected: IC9.6(S:AUX_DA) IC9.7(S:AUX_CL) IC9.22(S:CLKOUT) J1.1(DAT2) J1.8(DAT1) JP1.6

### Notes on the sheet
- Debug
- Encoder

## Library data of the parts
ANT1 = biomimetic:ANT8030-2R4-01A
B1 = biomimetic:HHM1710D1
C1-C15 C26 C30 C33 C36 C40-C47 = biomimetic:CAP: Capacitor Standard 0603 ceramic capacitor, and 0.1" leaded capacitor.
C16 C17 C48 = biomimetic:CAP: Capacitor Standard 0603 ceramic capacitor, and 0.1" leaded capacitor.; DIELECTRIC: C0G; TECHNOLOGY: CERAMIC; TOLERANCE: 5%; VOLTAGE: 50V
C18 C19 = biomimetic:CAP: Capacitor Standard 0603 ceramic capacitor, and 0.1" leaded capacitor.; DIELECTRIC: C0G; TECHNOLOGY: CERAMIC; TOLERANCE: 10%; VOLTAGE: 50V
C20 C22 = biomimetic:CAP: Capacitor Standard 0603 ceramic capacitor, and 0.1" leaded capacitor.; DIELECTRIC: X7R; TECHNOLOGY: CERAMIC; TOLERANCE: 10%; VOLTAGE: 16V
C21 C23 = biomimetic:CAP: Capacitor Standard 0603 ceramic capacitor, and 0.1" leaded capacitor.; DIELECTRIC: X5R; TECHNOLOGY: CERAMIC; TOLERANCE: 10%; VOLTAGE: 16V
C24 C25 C27 C28 = biomimetic:CAP: Capacitor Standard 0603 ceramic capacitor, and 0.1" leaded capacitor.; TECHNOLOGY: CERAMIC; VOLTAGE: 10V
C31 C34 = biomimetic:CAP: Capacitor Standard 0603 ceramic capacitor, and 0.1" leaded capacitor.; DIELECTRIC: X7R; TECHNOLOGY: CERAMIC; VOLTAGE: 16V
C32 C35 = biomimetic:CAP: Capacitor Standard 0603 ceramic capacitor, and 0.1" leaded capacitor.; TECHNOLOGY: CERAMIC; VOLTAGE: 6.3V
C37 = biomimetic:CAP: Capacitor Standard 0603 ceramic capacitor, and 0.1" leaded capacitor.; DIELECTRIC: X7R; TECHNOLOGY: CERAMIC; TOLERANCE: 10%; VOLTAGE: 4V
C38 = biomimetic:CAP: Capacitor Standard 0603 ceramic capacitor, and 0.1" leaded capacitor.; DIELECTRIC: X7R; TECHNOLOGY: CERAMIC; TOLERANCE: 10%; VOLTAGE: 50V
C39 = biomimetic:CAP: Capacitor Standard 0603 ceramic capacitor, and 0.1" leaded capacitor.; DIELECTRIC: X7R; TECHNOLOGY: CERAMIC; TOLERANCE: 10%; VOLTAGE: 2V
D1 = diode:DIODE-: DIODE
IC1 = biomimetic:XC61GC3002HR: Torex XC61GC3002HR-G 3.0V voltage detector. Digi-Key P/N: 893-1046-6-ND
IC2 = biomimetic:MIC5335-SPYMT: Micrel MIC5335 150mA dual (3.3V/3.0V) voltage regulator.; DIGIKEY: 576-1949-1-ND
IC3 = biomimetic:LTC6088: 14MHz, Rail-to-Rail Output, 12nV/Hz, 1.1mA Op Amp Source: http://cds.linear.com/docs/Datasheet/60878fb.pdf Digi-Key P/N: LTC6088HDHC#PBF-ND
IC5 = biomimetic:AT86RF233
IC7 IC8 = biomimetic:DRV8833: TI DRV8833 1.5A Dual H-Bridge Motor Driver IC Digi-Key P/N: 296-29513-6-ND
IC9 = biomimetic:MPU-6000: MPU-6000 3-axis gyro + 3-axis accelerometer, SPI/I2C interface with auxiliary I2C interface for magnetometer
J1 = pullin:CON-HRS-DM3AT: Hirose DM3AT microSD card connector Hirose DM3AT Push-Push (ejection mechanism), top board mounting microSD card connector Source: http://www.hirose.co.jp/cataloge_hp/e60900232.pdf; DIGI-KEY#: HR1964CT-ND; MF: Hirose; MPN: DM3AT-SF-PEJM5; TERMINATION-TYPE: Right-angle SMT (standard)
JP1-JP3 = biomimetic:MOLEX_503480-0600: Molex FPC connector, 6 pos.; DIGIKEY: WM1387CT-ND
JP6 = SparkFun-Connectors:USB: USB Connectors USB-B-PTH is fully proven SKU : PRT-00139/CONN-08278 USB-miniB is fully proven SKU : PRT-00587 USB-A-PCB is untested. USB-A-H is throughly reviewed, but untested. Spark Fun Electronics SKU : PRT-00437 USB-B-SMT is throughly reviewed, but untested. Needs silkscreen touching up. USB-A-S has not been used/tested USB-MB-H has not been used/tested USB-MICROB has been used. CONN-09505; PROD_ID: CONN-08193
L1 = pullin:SRN3015-100M
LED1-LED4 = biomimetic:LED: LEDs Standard schematic elements and footprints for 5mm, 3mm, 1206, and 0603 sized LEDs. 5mm - Spark Fun Electronics SKU : COM-00529 (and others)
OSC2 = biomimetic:NX2520SA-16.000000MHZ: 644-1059-6-ND
P1-P10 = wirepad:SMD2: SMD PAD
R1-R29 = biomimetic:RESISTOR: Resistor Basic schematic elements and footprints for 0603, 1206, and PTH resistors.
U1 = pullin:CY8C5688LTI-LP086
U2 = pullin:SIT8008AI-72-33E-24.000000G
U$4 = pullin:MCP73831

## Board
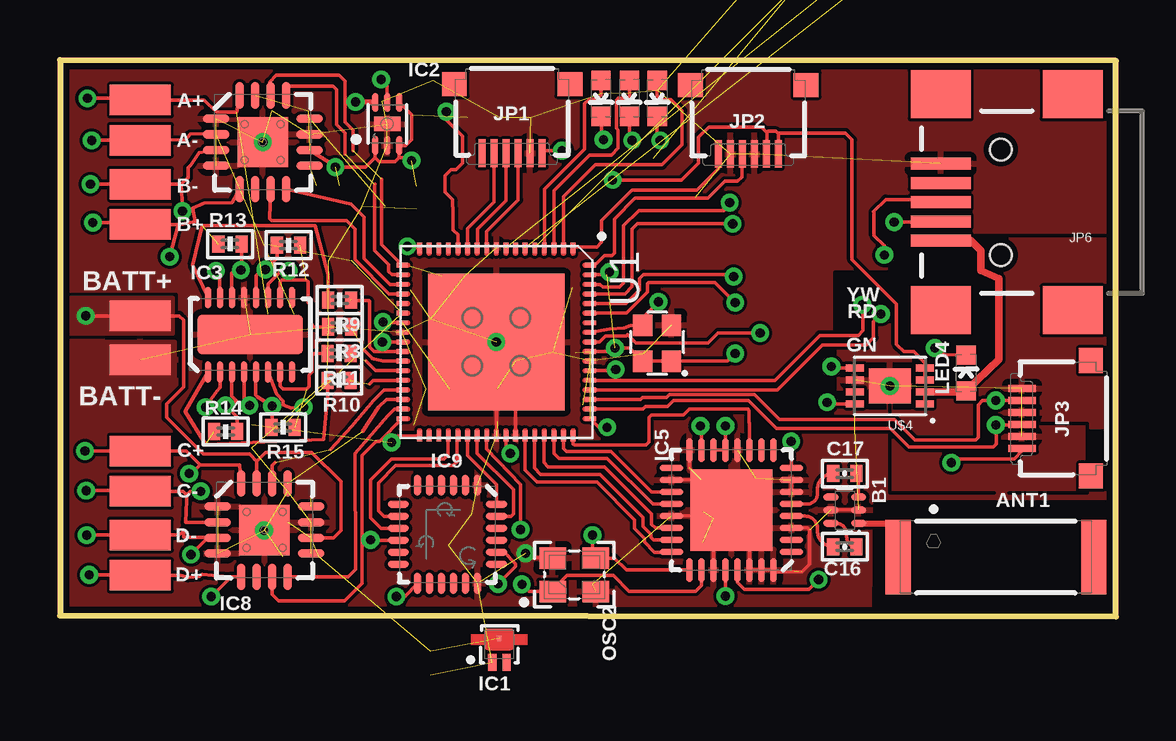
[diagram p5: board, top side]
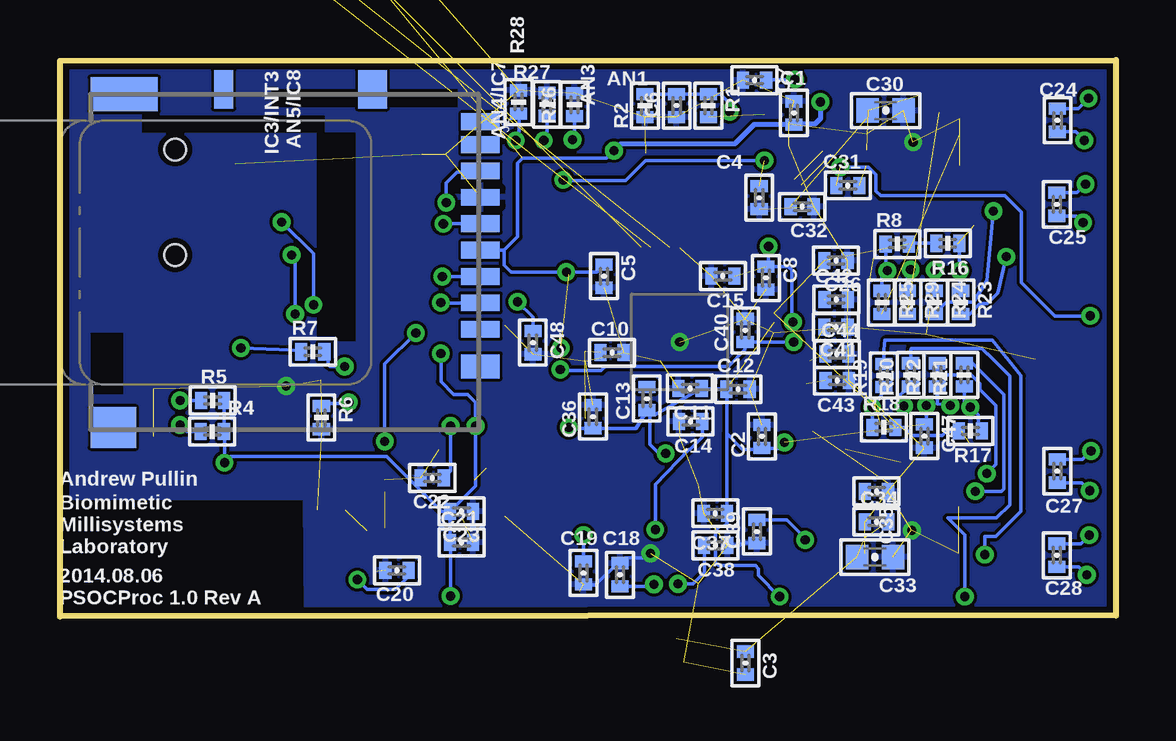
[diagram p6: board, bottom side, seen from below]

Size 44.02 x 23.2 mm. Coordinates in mm from the lower left corner, seen from the top.
Outline: 0,0.04 44.02,0 44.02,23.17 0,23.2 0,0.04
Copper layers (1*16): Top 2mil / dielectric 27mil / Bottom 2mil
Design rules "advancedcircuits-standard-biomimetic": minimum track width 5mil, minimum drill 10mil, track to track 5mil, track to pad 5mil, pad to pad 5mil, via to via 5mil, smd to smd 5mil, copper to edge 0.256540625mm, drill to drill 0.256540625mm, minimum pad ring 0.180340625mm, minimum via ring 0.180340625mm, stop-mask expansion 2mil, vias tented up to drill 0mil, thermal gap 10mil
tKeepout: 8 lines
bKeepout: 8 lines
tRestrict: 20 lines

### Footprints (pad centres in the part's own frame; a part is rotated, then mirrored left to right if it is on the bottom)
ANT8030-2R4-01A = smd 1.05 x 3.1: A -4.075,0; B 4.075,0
0603-BALUN = smd 0.3 x 0.65: 1 -0.55,-0.575; 2 0,-0.575; 3 0.55,-0.575; 4 -0.55,0.575; 5 0,0.575; 6 0.55,0.575
0402-CAP = smd 0.508 x 0.711: 1 -0.483,0; 2 0.483,0
0805 = smd 0.8 x 1.2: 1 -0.9,0; 2 0.9,0
0603-CAP = smd 0.94 x 1.016: 1 -0.749,0; 2 0.749,0
SOD123 = smd 1.4 x 1.4: A 1.9,0; C -1.9,0
USP-3 = smd 0.35 x 0.7: 1 0.3,0.75; 2 -0.3,0.75 | smd 0.2 x 0.2: 3 0,-0.25
MLF-6 = smd 0.25 x 0.8: 1 -0.5,-0.9; 2 0,-0.9; 3 0.5,-0.9; 4 0.5,0.9; 5 0,0.9; 6 -0.5,0.9 | smd 1.1 x 0.6: EPAD 0,0
DFN-16 = smd 0.25 x 0.9: 1 -1.75,-1.55; 2 -1.25,-1.55; 3 -0.75,-1.55; 4 -0.25,-1.55; 5 0.25,-1.55; 6 0.75,-1.55; 7 1.25,-1.55; 8 1.75,-1.55; 9 1.75,1.55; 10 1.25,1.55; 11 0.75,1.55; 12 0.25,1.55; 13 -0.25,1.55; 14 -0.75,1.55; 15 -1.25,1.55; 16 -1.75,1.55 | smd 4.4 x 1.65: PAD 0,0
VQFN-32QN2 = smd 1 x 0.28: 1 -2.5,1.75; 2 -2.5,1.25; 3 -2.5,0.75; 4 -2.5,0.25; 5 -2.5,-0.25; 6 -2.5,-0.75; 7 -2.5,-1.25; 8 -2.5,-1.75; 17 2.5,-1.75; 18 2.5,-1.25; 19 2.5,-0.75; 20 2.5,-0.25; 21 2.5,0.25; 22 2.5,0.75; 23 2.5,1.25; 24 2.5,1.75 | smd 0.28 x 1: 9 -1.75,-2.5; 10 -1.25,-2.5; 11 -0.75,-2.5; 12 -0.25,-2.5; 13 0.25,-2.5; 14 0.75,-2.5; 15 1.25,-2.5; 16 1.75,-2.5; 25 1.75,2.5; 26 1.25,2.5; 27 0.75,2.5; 28 0.25,2.5; 29 -0.25,2.5; 30 -0.75,2.5; 31 -1.25,2.5; 32 -1.75,2.5 | smd 3.4 x 3.4: PAD 0,0
S-PWQFN-N16 = smd 1.1 x 0.35: 1 -1.95,0.975; 2 -1.95,0.325; 3 -1.95,-0.325; 4 -1.95,-0.975; 9 1.95,-0.975; 10 1.95,-0.325; 11 1.95,0.325; 12 1.95,0.975 | smd 0.35 x 1.1: 5 -0.975,-1.95; 6 -0.325,-1.95; 7 0.325,-1.95; 8 0.975,-1.95; 13 0.975,1.95; 14 0.325,1.95; 15 -0.325,1.95; 16 -0.975,1.95 | smd 2.1 x 2.1: PPAD 0,0
QFN-24 = smd 0.9 x 0.3: 1 -2.05,1.25; 2 -2.05,0.75; 3 -2.05,0.25; 4 -2.05,-0.25; 5 -2.05,-0.75; 6 -2.05,-1.25; 13 2.05,-1.25; 14 2.05,-0.75; 15 2.05,-0.25; 16 2.05,0.25; 17 2.05,0.75; 18 2.05,1.25 | smd 0.3 x 0.9: 7 -1.25,-2.05; 8 -0.75,-2.05; 9 -0.25,-2.05; 10 0.25,-2.05; 11 0.75,-2.05; 12 1.25,-2.05; 19 1.25,2.05; 20 0.75,2.05; 21 0.25,2.05; 22 -0.25,2.05; 23 -0.75,2.05; 24 -1.25,2.05
HRS-DM3AT = smd 0.7 x 1.6: 1 2.54,9.69; 2 1.44,9.69; 3 0.34,9.69; 4 -0.76,9.69; 5 -1.86,9.69; 6 -2.96,9.69; 7 -4.06,9.69; 8 -5.16,9.69; B -6.11,9.69 | smd 1.6 x 0.8: A -7.46,-1.01 | smd 1.6 x 1.2: MNT@1 -7.46,5.19 | smd 1.4 x 2.8: MNT@2 -7.26,-5.16 | smd 1.7 x 1.9: MNT@3 6.64,-5.61 | smd 1 x 1.6: MNT@4 4.09,9.69
MOLEX_503480-0600 = smd 0.3 x 1.15: 1 -1.25,1.725; 2 -0.75,1.725; 3 -0.25,1.725; 4 0.25,1.725; 5 0.75,1.725; 6 1.25,1.725 | smd 1.035 x 1: L -2.408,-1.15; R 2.408,-1.15
USB-MINIB = smd 2.5 x 0.5: D+ 2.5,0; D- 2.5,0.8; GND 2.5,-1.6; ID 2.5,-0.8; VBUS 2.5,1.6 | smd 2.5 x 2: MTN1 -3,4.5; MTN2 2.5,4.5; MTN3 -3,-4.5; MTN4 2.5,-4.5 | hole 0.9: 0,2.2; 0,-2.2
INDUCTOR_SMD_3X3 = smd 2.7 x 1: P$1 0,1.1; P$2 0,-1.1
LED-0603 = smd 0.8 x 0.8: A 0,-0.75; C 0,0.75
CRYSTAL-SMD = smd 1.1 x 0.9: 1 -0.9,-0.7; 2 0.9,-0.7; 3 0.9,0.7; 4 -0.9,0.7
SMD1,27-2,54 = smd 1.27 x 2.54: 1 0,0
0402-RES = smd 0.508 x 0.711: 1 -0.483,0; 2 0.483,0
68QFN = smd 0.45 x 0.2: 1 -3.925,3.2; 2 -3.925,2.8; 3 -3.925,2.4; 4 -3.925,2; 5 -3.925,1.6; 6 -3.925,1.2; 7 -3.925,0.8; 8 -3.925,0.4; 9 -3.925,0; 10 -3.925,-0.4; 11 -3.925,-0.8; 12 -3.925,-1.2; 13 -3.925,-1.6; 14 -3.925,-2; 15 -3.925,-2.4; 16 -3.925,-2.8; 17 -3.925,-3.2; 35 3.925,-3.2; 36 3.925,-2.8; 37 3.925,-2.4; 38 3.925,-2; 39 3.925,-1.6; 40 3.925,-1.2; 41 3.925,-0.8; 42 3.925,-0.4; 43 3.925,0; 44 3.925,0.4; 45 3.925,0.8; 46 3.925,1.2; 47 3.925,1.6; 48 3.925,2; 49 3.925,2.4; 50 3.925,2.8; 51 3.925,3.2 | smd 0.2 x 0.45: 18 -3.2,-3.925; 19 -2.8,-3.925; 20 -2.4,-3.925; 21 -2,-3.925; 22 -1.6,-3.925; 23 -1.2,-3.925; 24 -0.8,-3.925; 25 -0.4,-3.925; 26 0,-3.925; 27 0.4,-3.925; 28 0.8,-3.925; 29 1.2,-3.925; 30 1.6,-3.925; 31 2,-3.925; 32 2.4,-3.925; 33 2.8,-3.925; 34 3.2,-3.925; 52 3.2,3.925; 53 2.8,3.925; 54 2.4,3.925; 55 2,3.925; 56 1.6,3.925; 57 1.2,3.925; 58 0.8,3.925; 59 0.4,3.925; 60 0,3.925; 61 -0.4,3.925; 62 -0.8,3.925; 63 -1.2,3.925; 64 -1.6,3.925; 65 -2,3.925; 66 -2.4,3.925; 67 -2.8,3.925; 68 -3.2,3.925 | smd 5.7 x 5.7: CENTER_PAD 0,0
4-SMD = smd 0.9 x 0.8: 1 -0.75,-0.6; 2 0.75,-0.6; 3 0.75,0.6; 4 -0.75,0.6
DFN-8 = smd 0.3 x 0.75: 1 -0.75,-1.45; 2 -0.25,-1.45; 3 0.25,-1.45; 4 0.75,-1.45; 5 0.75,1.45; 6 0.25,1.45; 7 -0.25,1.45; 8 -0.75,1.45 | smd 1.45 x 1.75: PAD 0,0

### Placement (x,y rotation side)
ANT1  39.01,2.48 0 top
B1  32.72,4.43 90 top
C1  13.42,20.99 90 bottom
C2  14.76,7.51 90 bottom
C3  15.44,-1.94 270 bottom
C4  14.87,17.46 90 bottom
C5  21.34,14.19 270 bottom
C6  18.31,21.3 270 bottom
C7  15.06,22.36 180 bottom
C8  14.59,14.11 270 bottom
C9  38.44,33.22 180 top  (outside the outline)
C10  21.01,11 0 bottom
C11  17.75,9.51 180 bottom
C12  15.75,9.47 0 bottom
C13  19.56,9.08 90 bottom
C14  17.73,8.13 180 bottom
C15  16.38,14.19 180 bottom
C16  32.72,2.91 0 top
C17  32.72,5.96 180 top
C18  20.68,1.74 90 bottom
C19  22.2,1.82 270 bottom
C20  29.97,1.92 0 bottom
C21  27.28,3.09 0 bottom
C22  28.5,5.78 0 bottom
C23  27.28,4.38 0 bottom
C24  2.44,20.69 270 bottom
C25  2.46,17.18 90 bottom
C26  11.67,14.83 0 bottom
C27  2.45,6.06 270 bottom
C28  2.46,2.55 90 bottom
C30  9.6,21.09 0 bottom
C31  11.18,17.97 0 bottom
C32  13.08,17.08 0 bottom
C33  10.05,2.48 0 bottom
C34  9.98,3.95 180 bottom
C35  9.98,5.22 0 bottom
C36  21.81,8.33 90 bottom
C37  16.7,4.31 180 bottom
C38  16.69,2.96 180 bottom
C39  14.96,3.54 90 bottom
C40  15.46,11.93 90 bottom
C41  11.67,12.06 0 bottom
C42  11.66,13.21 0 bottom
C43  11.62,9.83 0 bottom
C44  11.63,10.93 0 bottom
C45  33.58,30.84 180 top  (outside the outline)
C46  33.9,32.38 180 top  (outside the outline)
C47  7.99,7.52 270 bottom
C48  24.31,11.42 270 bottom
D1  36.04,30.31 270 top  (outside the outline)
IC1  18.31,-1.16 180 top
IC2  13.64,20.54 0 top
IC3  7.92,11.75 0 top
IC5  27.99,4.43 180 top
IC7  8.46,19.77 0 top
IC8  8.52,3.61 0 top
IC9  16.15,3.42 270 top
J1  36.18,14.52 270 bottom
JP1  18.85,21.04 180 top
JP2  28.69,21 180 top
JP3  41.83,8.26 90 top
JP6  39.22,17.27 180 top
L1  38.9,30.48 0 top  (outside the outline)
LED1  22.56,21.6 180 top
LED2  23.74,21.6 180 top
LED3  24.89,21.6 180 top
LED4  37.77,10.15 0 top
OSC2  21.44,1.74 0 top
P1  3.35,12.53 90 top
P2  3.35,10.71 90 top
P3  3.35,21.53 90 top
P4  3.35,19.85 270 top
P5  3.35,16.34 90 top
P6  3.35,18.02 90 top
P7  3.35,6.9 90 top
P8  3.35,5.22 270 top
P9  3.35,1.71 90 top
P10  3.35,3.39 270 top
R1  16.99,21.3 270 bottom
R2  19.63,21.3 90 bottom
R3  11.66,12.08 180 top
R4  37.67,7.71 0 bottom
R5  37.66,9 0 bottom
R6  33.12,8.29 270 bottom
R7  33.48,11.04 0 bottom
R8  9.12,15.53 0 bottom
R9  11.66,13.2 180 top
R10  11.63,9.84 180 top
R11  11.63,10.96 180 top
R12  9.53,15.48 180 top
R13  7.09,15.53 0 top
R14  6.91,7.71 0 top
R15  9.3,7.89 180 top
R16  7.01,15.56 180 bottom
R17  6.07,7.73 180 bottom
R18  9.68,7.89 0 bottom
R19  9.68,10.05 90 bottom
R20  8.56,10.07 90 bottom
R21  6.32,10.07 90 bottom
R22  7.44,10.07 90 bottom
R23  6.48,13.09 270 bottom
R24  7.57,13.09 270 bottom
R25  9.75,13.09 270 bottom
R26  22.57,21.34 90 bottom
R27  23.72,21.35 90 bottom
R28  24.9,21.45 90 bottom
R29  8.69,13.09 270 bottom
U1  18.19,11.45 270 top
U2  24.89,11.39 90 top
U$4  34.59,9.61 90 top

### Tracks (layer width: path | path; a pad name or v marks a point on that pad's centre or on a via)
3.0V  (via drill 0.38)
  Top 0.152: IC2.5 13.64,22.14 v13.39,22.39
  Bottom 0.152: v13.39,22.39 14.55,22.39 C7.1
3.3V  (via drill 0.38)  (10 unrouted)
  Top 0.152: IC5.28 v27.74,0.86 v27.74,0.85 | v20.93,19.42 20.2,19.42 JP1.1 | JP3.1 40.1,6.89 39.78,6.57 37.31,6.57 v37.16,6.41 | U1.67 22.79,14.25 v22.91,14.36 | v22.81,7.89 22.47,7.89 U1.52 | U1.17 14.54,15.37 v14.48,15.43 | U1.35 14.09,7.52 v13.82,7.25 | 22.12,11.04 22.99,11.04 v23.14,11.19 23.75,11.19 U2.4 U2.1 27.82,10.64 v28.14,10.96 | U1.44 18.59,6.98 v18.77,6.79 | v14.02,0.83 14.36,0.83 IC9.13 | IC3.4 7.67,9.03 v7.9,8.8 | U1.24 13.5,12.25 v13.46,12.28 | IC5.15 26.74,7.89 v26.7,7.94
  Top 0.203: IC2.6 12.33,21.44 v12.32,21.45
  Top 0.254: 13.14,21.53 IC2.6
  Bottom 0.152: 27.69,3.01 C21.1 | R5.2 37.17,7.72 R4.2 37.16,7.68 v37.16,6.41 36.91,6.67 30.4,6.67 28.12,4.38 C23.1 | 16.22,7.62 C37.1 16.22,3.89 16.36,3.75 16.54,3.75 16.69,3.59 16.69,2.25 16.56,2.12 15.04,2.12 14.91,1.99 14.91,1.71 v14.02,0.83 | v27.74,0.85 27.74,3.06 C21.1 | C21.1 C23.1 | J1.4 25.5,15.28 | 25.5,15.28 24.94,15.84 24.94,18.91 24.74,19.11 21.23,19.11 v20.93,19.42 | C5.1 21.64,14.36 v22.91,14.36 25.22,14.36 25.5,14.64 25.5,15.27 25.5,15.28 | v22.81,7.89 22.77,7.85 C36.1 20,7.85 C13.1 | v14.48,15.43 14.48,14.71 C8.1 13.66,14.59 13.51,14.44 13.51,12.33 v13.46,12.28 | v13.82,7.25 14.07,7 14.73,7 C2.1 14.81,6.97 15.57,6.97 16.22,7.62 | 22.99,11.04 v23.14,11.19 | v18.77,6.79 19.05,6.79 19.43,7.18 19.43,8.37 C13.1 | 16.22,7.62 16.22,9.21 C12.1 C11.1 19.23,8.4 C13.1 | v7.9,8.8 7.9,8.09 C47.1 | C23.1 26.7,5.45 v26.7,7.94 26.7,8.93 27.03,9.26 27.61,9.26 28.14,9.79 v28.14,10.96
  Bottom 0.203: v12.32,21.45 12.32,20.76 12.55,20.54 13.65,20.54 C1.1 15.09,20.51 15.9,19.7 20.65,19.7 v20.93,19.42
5V_USB
  Top 0.152: U$4.2 U$4.1
  Top 0.305: JP6.VBUS 37.96,15.67 38.38,15.25 38.38,14.41 39.14,14.08 39.14,10.72 LED4.A 37.3,9.36 U$4.2
24MHZ  (via drill 0.38)
  Top 0.152: U1.61 22.56,11.93 22.91,11.98 23.52,12.03 23.77,12.13 U2.3 24.29,12.47 v24.94,13.12
  Bottom 0.152: v24.94,13.12 24.31,12.48 C48.1
!SS1
  Top 0.152: U1.47 19.79,7.49 19.79,6.19 20.04,5.93 22.5,5.93 24.31,4.13 24.31,3.75 24.64,3.42 24.64,3.29 24.74,3.19 IC5.23
!SS2
  Top 0.152: IC9.8 13.52,4.17 13.28,4.41 13.28,5.58 13.99,6.29 16.38,6.29 16.56,6.44 16.56,7.49 U1.39
!XRES
  Top 0.152: JP1.3 19.1,17.36 17.78,16.04 U1.10
BATT_LEVEL  (via drill 0.38)
  Top 0.152: v16.1,21.04 16.1,20.71 16.79,20.03 16.79,18.91 16.51,18.63 16.31,18.63 16.05,18.38 16.05,17.69 16.36,17.39 16.36,17.08 16.38,17.06 16.38,16.12 16.59,15.91 U1.13
  Bottom 0.152: R2.2 C6.1 R1.1 16.48,21.78 16.13,21.43 16.13,21.07 v16.1,21.04
EMFILE_CS  (via drill 0.38)
  Top 0.152: U1.63 23.61,12.65 24.49,13.53 24.49,13.88 24.54,13.93 27.3,13.93 v28.14,13.09
  Bottom 0.152: J1.2 28.13,13.08 v28.14,13.09
EMFILE_MISO  (via drill 0.38)
  Top 0.152: U1.66 22.52,13.85 22.63,13.73 23.32,13.73 23.5,13.91 23.5,16.29 24.13,16.93 27.69,16.93 27.69,17.03 v27.91,17.26
  Bottom 0.152: v27.91,17.26 27.91,18.07 27.46,18.53 26.54,18.53 J1.7
EMFILE_MOSI  (via drill 0.38)
  Top 0.152: U1.64 23.6,13.05 24.16,13.6 24.16,14.08 24.33,14.26 28,14.26 v28.08,14.18
  Bottom 0.152: J1.3 v28.08,14.18
EMFILE_SCK  (via drill 0.38)
  Top 0.152: U1.65 23.54,13.45 23.85,13.75 23.85,16.14 24.08,16.37 v28.04,16.37
  Bottom 0.152: J1.5 v28.04,16.38 v28.04,16.37
GN_LED
  Top 0.152: U1.3 20.59,17.76 22.07,19.24 22.99,19.24 23.27,19.52 23.27,20.28 23.19,20.36 23.19,21.53 23.27,21.6 23.67,21.6 23.75,21.68 LED2.A
GND  (via drill 0.38)  (78 unrouted)
  Top 0.152: IC5.3 31.15,3.68 31.24,3.59 31.24,2.17 30.94,1.87 29.81,1.87 IC5.32 IC5.31 IC5.30 28.74,3.68 IC5.PAD | B1.2 B1.5 32.36,4.43 | IC5.21 27.33,4.18 | 27.33,4.18 27.74,4.18 IC5.PAD | IC5.18 26.74,5.68 | IC5.16 26.24,6.18 IC5.PAD | OSC2.4 19.59,2.44 v19.41,2.63 | IC5.7 IC5.6 | U1.43 U1.CENTER_PAD 18.99,10.65 U1.45 | IC5.27 27.24,4.09 27.33,4.18
  Bottom 0.152: v19.41,2.63 19.58,2.45 20.45,2.45 C18.2 20.78,2.22 21.69,1.31 22.17,1.31 C19.2 | C39.1 15.57,3.06 15.67,2.96 C38.1
  other vias: 34.59,9.61 18.19,11.44 8.46,19.77 8.51,3.59
  pour Top (rank 6): 0,23.2 46.13,23.2 46.13,4.91 33.82,4.91 33.78,0.04 0,0.04
  pour Bottom (rank 6): 0,23.2 49.94,23.2 49.94,4.91 33.82,4.91 33.78,0.04 0,0.04
  pour Top (no thermals): 4.8,11.47 0,11.47 0,9.87 4.8,9.87
IND  (2 unrouted)
MOTOR_A_BEMF  (2 unrouted)
  Top 0.152: U1.28 13.47,10.65 13.01,10.76 13.01,10.78 12.65,11.14
MOTOR_A_IN1  (1 unrouted)
  Top 0.152: IC7.14 8.73,22.28 9.02,22.57 11.63,22.57 11.89,22.31 11.89,20.61 12.22,20.28 12.22,19.42 | 13.41,18.22 13.41,15.5 U1.18
MOTOR_A_IN2  (1 unrouted)
  Top 0.152: IC7.13 9.38,21.89 9.6,22.11 11.38,22.11 11.53,21.96 11.53,20.51 11.89,20.16 11.89,19.27 | U1.19 13.83,14.25 13.69,14.39 13.69,14.67 13.11,15.25 13.11,18 13.13,18.02
MOTOR_A_OUT1  (via drill 0.38)  (1 unrouted)
  Top 0.152: v1.14,21.6 3.28,21.6 P3.1 6.02,21.53 6.53,21.02 7.36,21.02 IC7.16
  Bottom 0.152: C24.1 1.57,21.17 v1.14,21.6
MOTOR_A_OUT2  (via drill 0.38)  (1 unrouted)
  Top 0.152: v1.32,19.85 P4.1 5.23,19.88 5.44,20.1 6,20.13 IC7.2
  Bottom 0.152: C24.2 1.68,20.21 v1.32,19.85
MOTOR_B_BEMF  (1 unrouted)
  Top 0.152: U1.27 13.1,11.05 12.9,11.24 12.9,13.14 12.88,13.17 12.17,13.17 R9.1
MOTOR_B_IN1
  Top 0.152: IC7.7 8.73,16.58 8.81,16.5 11.94,16.5 12.29,16.14 12.29,14.87 13.72,13.45 U1.21
MOTOR_B_IN2
  Top 0.152: IC7.8 12.13,17.19 12.68,16.65 12.68,14.92 13.75,13.85 U1.20
MOTOR_B_OUT1  (via drill 0.38)
  Top 0.152: v1.37,16.42 3.28,16.42 P5.1 5,16.35 | 5,16.35 5.64,16.47 5.54,17.03 6.02,17.23 7.18,17.26 IC7.5 | v4.57,15 4.9,16.24 5,16.35
  Bottom 0.152: C25.1 1.65,16.7 v1.37,16.42 | R23.2 6.1,12.61 5.66,13.04 5.36,13.04 4.93,13.48 4.6,14.95 v4.57,15
MOTOR_B_OUT2  (via drill 0.38)
  Top 0.152: v1.27,18.02 P6.1 5.05,18.02 | 5.05,18.02 5.33,18.3 5.33,18.71 5.46,18.83 5.8,19.34 IC7.3 | 5.05,18.02 5.11,17.03 v5.11,16.9
  Bottom 0.152: C25.2 1.63,17.67 v1.27,18.02 | v5.11,16.9 5.38,13.98 5.94,13.12 7.06,13.12 R24.2
MOTOR_C_BEMF  (2 unrouted)
  Top 0.152: U1.30 13.06,9.85 12.9,9.69
MOTOR_C_IN1  (1 unrouted)
  Top 0.152: IC8.14 8.85,6.29 8.97,6.41 | 11.28,6.97 12.17,7.91 13.08,9 13.51,9.44 14.26,9.44 U1.31
MOTOR_C_IN2  (1 unrouted)
  Top 0.152: 12.62,7.71 13.28,8.73 13.61,9.06 U1.32
MOTOR_C_OUT1  (via drill 0.38)
  Top 0.152: v1.04,6.9 P7.1 5.26,6.9 5.84,6.31 | 5.84,6.31 7.49,6.31 IC8.16 | v5.38,5.96 5.49,5.96 5.84,6.31
  Bottom 0.152: C27.1 1.4,6.54 v1.04,6.9 | R22.2 7.44,10.15 7.37,10.07 6.02,10.07 5.66,9.72 5.66,9.46 5,8.8 5,6.34 v5.38,5.96
MOTOR_C_OUT2  (via drill 0.38)
  Top 0.152: v1.09,5.25 3.33,5.25 P8.1 5.13,5.22 5.28,5.07 | 5.28,5.07 5.28,4.84 5.23,3.92 6.33,3.92 IC8.2 | v5.87,5.22 5.44,5.22 5.28,5.07
  Bottom 0.152: C27.2 1.42,5.58 v1.09,5.25 | R21.2 5.97,10.55 4.67,9.26 4.67,5.32 4.78,5.22 v5.87,5.22
MOTOR_D_BEMF  (2 unrouted)
  Top 0.152: U1.29 13.16,10.25 12.75,10.66
MOTOR_D_IN1
  Top 0.152: IC8.7 8.85,0.92 9.12,0.65 11.86,0.65 12.6,1.38 12.6,6.72 13.18,7.3 13.32,7.3 U1.34
MOTOR_D_IN2
  Top 0.152: IC8.8 12.01,1.66 12.32,1.97 12.29,6.79 13.66,8.37 13.94,8.65 U1.33
MOTOR_D_OUT1  (via drill 0.38)
  Top 0.152: v1.22,1.74 3.33,1.74 P9.1 5.03,1.71 5.33,1.64 5.82,1.66 5.92,1.77 6.8,1.66 IC8.5 7.13,1.66 v6.3,0.83
  Bottom 0.152: C28.1 1.55,2.07 v1.22,1.74 | v6.3,0.83 6.3,3.39 7.01,4.1 4.98,4.1 4.42,4.66 4.42,10.02 5.33,10.94 5.36,10.94 5.59,11.16 8.53,11.16 8.56,11.14 R20.2
MOTOR_D_OUT2  (via drill 0.38)
  Top 0.152: v1.12,3.39 P10.1 4.98,3.39 5.16,3.57 5.16,3.32 5.18,3.29 6.44,3.29 IC8.3 6.17,3.28 v5.46,2.58
  Bottom 0.152: C28.2 1.47,3.04 v1.12,3.39 | v5.46,2.58 5.46,3.34 5,3.34 3.96,4.38 3.96,10.05 5.16,11.52 9.63,11.52 9.68,11.14 R19.2
N$1  (via drill 0.38)
  Top 0.152: IC5.14 IC5.13 v27.74,7.93 v27.74,7.94
  Bottom 0.152: v27.74,7.94 27.74,6.06 C22.2
N$2  (1 unrouted)
N$3  (via drill 0.38)
  Top 0.152: IC5.29 28.24,1.41 28.52,1.13 31.22,1.13 v31.62,1.54
  Bottom 0.152: v31.62,1.54 31.22,1.13 30.02,1.13 29.49,1.66 C20.2
N$4
  Top 0.254: B1.1 34.64,3.88 34.8,3.72 34.8,2.62 ANT1.A
N$5  (via drill 0.38)
  Top 0.152: U$4.8 32.04,8.86 v31.98,8.93
  Bottom 0.152: v31.98,8.93 32.03,8.88 33.02,8.88 R6.1
N$6
  Top 0.152: 32.26,2.91 C16.1 arc-90 31.57,3.57 31.57,3.67 arc90 31.06,4.18 IC5.4
N$7
  Top 0.152: 32.26,5.96 C17.2 arc90 31.57,5.3 31.57,5.12 arc-90 31.14,4.68 IC5.5
N$8  (via drill 0.38)
  Top 0.152: IC5.25 23.61,1.93 23.11,2.43 22.35,2.43 OSC2.3 22.2,2.58 v22.2,3.39
  Bottom 0.152: C19.1 v22.2,3.39
N$9  (via drill 0.38)
  Top 0.152: v19.25,1.33 19.55,1.04 OSC2.1 20.54,1.12 21.13,1.71 23.06,1.71 23.72,1.05 26.49,1.05 26.74,1.3 IC5.26
  Bottom 0.152: 20.6,1.33 C18.1 19.33,1.26 v19.25,1.33
N$10
  Top 0.152: C17.1 arc-90 33.29,5.86 B1.3
N$11  (via drill 0.38)
  Top 0.152: LED4.C 36.84,10.92 v36.47,11.19
  Bottom 0.152: v36.47,11.19 33.83,11.09 R7.1
N$12
  Top 0.152: C16.2 arc-90 32.79,3.32 32.79,3.44 arc90 32.35,3.88 B1.4
N$15  (via drill 0.38)
  Top 0.152: v22.66,19.88 22.58,19.95 22.58,20.83 LED1.C
  Bottom 0.152: R26.1 22.57,19.96 v22.66,19.88
N$16  (via drill 0.38)
  Top 0.152: LED2.C 23.74,19.96 v23.85,19.85
  Bottom 0.152: v23.85,19.85 23.72,19.98 R27.1
N$17  (via drill 0.38)
  Top 0.152: LED3.C 24.89,19.98 v25.02,19.85
  Bottom 0.152: v25.02,19.85 24.89,19.98 24.89,20.96 R28.1
N$18  (1 unrouted)
N$19  (1 unrouted)
N$20  (1 unrouted)
N$21  (via drill 0.38)
  Top 0.152: U$4.5 32.22,10.36 v32.16,10.43
  Bottom 0.152: v32.16,10.43 32.77,10.43 32.84,10.5 32.84,11.01 R7.2
N$22  (via drill 0.38)
  Top 0.152: IC3.14 7.16,13.31 7.16,14.31 7.29,14.44 v7.54,14.44 7.57,14.47 R13.2
  Bottom 0.152: R24.1 7.57,14.41 v7.54,14.44
N$23  (via drill 0.38)
  Top 0.152: v6.5,14.41 6.6,14.41 6.66,14.36 6.66,13.32 IC3.15
  Bottom 0.152: R23.1 6.48,14.39 v6.5,14.41 6.53,14.44 R16.1
N$24  (via drill 0.38)
  Top 0.152: IC3.3 7.16,10.19 7.16,9.18 7.39,8.95 v6.91,8.8 7.39,8.32 R14.2
  Bottom 0.152: R22.1 7.44,8.85 v6.91,8.8
N$25  (via drill 0.38)
  Top 0.152: v6.07,8.73 6.53,9.39 6.68,9.54 IC3.2
  Bottom 0.152: R21.1 6.33,8.9 v6.07,8.73 5.74,8.4 5.74,7.84 R17.1
N$26  (via drill 0.38)
  Top 0.152: IC3.5 8.15,10.18 8.15,9.23 8.23,9.16 v8.84,8.78 8.84,7.91 R15.2
  Bottom 0.152: R20.1 9.17,9.11 v8.84,8.78
N$27  (via drill 0.38)
  Top 0.152: IC3.6 9.03,9.27 9.3,8.98 9.3,8.83 9.63,8.7 v10.16,8.73
  Bottom 0.152: R19.1 9.6,9.49 v10.16,8.73 R18.1
N$29  (via drill 0.38)
  Top 0.152: IC9.20 18.52,2.67 19,2.2 19,2.1 v18.26,1.36
  Bottom 0.152: v18.26,1.36 17.63,1.36 17.14,1.84 17.14,2.93 C38.2
N$30  (via drill 0.38)
  Top 0.152: IC3.12 8.18,14.21 8.43,14.47 v8.56,14.47 9.04,14.95 R12.2
  Bottom 0.152: R29.1 8.69,14.34 v8.56,14.47
N$31  (via drill 0.38)
  Top 0.152: IC3.11 8.69,13.31 8.69,13.86 9.25,14.41 v9.53,14.41 9.63,14.52
  Bottom 0.152: R25.1 9.75,14.19 v9.53,14.41 9.6,14.49 R8.1
N$32  (via drill 0.38)
  Top 0.152: IC9.10 12.97,3.17 v12.95,3.19
  Bottom 0.152: v12.95,3.19 12.95,3.26 13.72,4.03 C39.2
N$34  (1 unrouted)
  Top 0.152: IC3.7 9.18,9.61 9.3,9.49 10.29,9.49 10.39,9.59 10.39,10.07 10.52,10.2 10.52,10.88 10.59,10.96 R11.2
N$35  (1 unrouted)
  Top 0.152: IC3.1 5.21,8.54 6.07,7.18 11,7.38 11.15,9.18 R10.2
N$36  (1 unrouted)
  Top 0.152: IC3.10 9.18,13.96 9.25,14.03 10.26,14.03 10.34,13.96 10.34,13.09 10.46,12.97 10.46,12.21 10.59,12.08 R3.2
N$37  (1 unrouted)
  Top 0.152: IC3.16 5.54,14.65 5.92,16.29 10.64,16.29 11.18,14.26 R9.2
RADIO_!RST  (via drill 0.38)
  Top 0.152: IC5.8 v30.49,7.29 v30.48,7.3 | v29.18,11.82 27.43,11.82 27,11.39 24,11.39 23.65,11.75 23.6,11.7 22.73,11.7 22.48,11.45 U1.60
  Bottom 0.152: v30.48,7.3 30.48,10.53 v29.18,11.82
RADIO_IRQ
  Top 0.152: U1.46 19.38,7.49 19.38,6.11 19.89,5.6 22.38,5.6 23.95,4.03 23.95,3.67 24.36,3.26 24.36,3.11 24.79,2.68 IC5.24
RADIO_SLP_TR
  Top 0.152: U1.51 21.39,7.2 21.44,7.15 24.43,7.15 24.56,7.28 24.56,8.29 24.66,8.4 25.98,8.4 26.24,8.65 28.68,8.65 28.73,8.6 28.73,8.09 28.74,8.08 IC5.11 28.75,6.94
RD_LED
  Top 0.152: U1.2 20.99,17.5 22.33,18.83 25.09,18.83 25.93,19.67 25.93,21.1 25.48,21.55 25.04,21.55 24.89,21.7 LED3.A
SCK1
  Top 0.152: IC5.19 24.65,5.18 22.96,6.87 21.11,6.87 20.98,7 U1.50
SCK2
  Top 0.152: U1.41 17.39,6.8 18.9,5.3 18.9,4.28 18.8,4.18 IC9.23
SCL1  (via drill 0.38)
  Top 0.152: JP3.3 40.08,7.99 v39.01,7.99 39.04,7.96 39.04,7.2 38.91,7.07 35.38,7.07 34.62,7.84 29.87,7.84 28.7,9 25.58,9 25.32,8.75 24.41,8.75 24.3,8.65 U1.53
  Bottom 0.152: R4.1 38.73,7.71 v39.01,7.99
SDA1  (via drill 0.38)
  Top 0.152: JP3.5 v39.02,9.01 v39.01,9 38.46,9 38.28,8.83 38.28,7.46 38.18,7.35 35.64,7.35 34.77,8.22 30,8.22 28.96,9.26 25.4,9.26 25.27,9.13 24.28,9.13 24.2,9.05 U1.54
  Bottom 0.152: v39.01,9 R5.1
SDI1
  Top 0.152: IC5.20 24.72,4.68 22.81,6.59 20.8,6.59 20.6,6.79 U1.49
SDI2
  Top 0.152: IC9.9 13.38,3.67 12.95,4.1 12.95,5.7 13.82,6.57 16,6.57 16.18,6.74 U1.38
SDO1
  Top 0.152: U1.48 20.17,7.5 20.17,6.41 20.34,6.24 22.71,6.24 24.66,4.28 24.66,3.85 24.82,3.7 25.48,3.7 IC5.22
SDO2
  Top 0.152: IC9.24 18.2,5.51 16.99,6.72 U1.40
SWD_SCLK
  Top 0.152: JP1.5 18.1,17.27 16.99,16.17 U1.12
SWD_SDAT
  Top 0.152: JP1.4 18.6,17.34 17.4,16.14 17.4,15.38 U1.11
U1RX
  Top 0.152: JP2.6 27.44,18.67 26.54,17.77 23.85,17.77 22.58,16.5 22.58,15.61 22.38,15.41 21.42,15.41 U1.1
U1TX
  Top 0.152: U1.68 22.3,14.65 22.71,15.05 23.01,15.05 23.11,15.15 23.11,16.57 23.98,17.44 27,17.44 27.71,18.15 28.25,18.15 28.42,18.33 28.42,19.26 JP2.4
USB_D+  (via drill 0.38)
  Top 0.152: U1.55 29.91,9.45 31.77,11.32 33.6,11.32 33.91,11.62 33.91,12.31 v34.21,12.61 | JP6.D+ 36.6,17.39 34.42,17.39 33.91,16.88 33.93,16.85 33.93,15.89 34.37,15.46 v34.37,15.08
  Bottom 0.152: v34.21,12.61 34.21,14.92 v34.37,15.08
USB_D-  (via drill 0.38)
  Top 0.152: U1.56 29.8,9.85 31.67,11.72 33.27,11.72 33.48,11.93 33.48,12.97 v33.45,12.99 | v34.77,16.45 36.69,16.45 JP6.D-
  Bottom 0.152: v33.45,12.99 33.45,15.13 v34.77,16.45
V_BATT  (via drill 0.38)  (9 unrouted)
  Top 0.152: U$4.3 U$4.4 36.05,10.58 35.59,11.04 35.18,11.04 34.87,11.34 34.87,13.02 33.02,14.87 33.02,19.88 32.74,20.16 29.97,20.16 29.94,20.13 | v1.07,12.54 P1.1 4.98,12.54 5.16,12.36 5.16,9.56 4.45,8.85 4.45,8.29 5.97,6.77 7.9,6.77 8.2,6.47 | IC7.10 11.4,18.81 v11.48,18.73 12.74,18.73 13.14,19.13 | IC2.1 13.14,19.13 | 13.14,19.13 13.31,18.96 13.97,18.96 14.14,19.13 | 14.14,19.13 IC2.3 14.42,19.64 14.66,19.88 14.66,20.92 IC2.4 | 14.14,19.13 14.54,19.13 v14.66,19.01 | v23.04,18.2 25.91,18.2 26.62,18.91 26.62,19.98 27.05,20.41 29.23,20.41 29.46,20.18 | 29.46,20.18 29.46,19.3 JP2.2 | JP2.1 29.94,20.13 | 29.94,20.13 29.84,20.23 29.52,20.23 29.46,20.18 | IC8.15 8.2,6.47 | IC8.10 11.4,3.28 11.71,3.59 11.71,5.63 10.49,6.85 8.57,6.85 8.2,6.47
  Bottom 0.152: v1.07,12.54 2.54,12.54 3.94,13.93 3.94,16.85 4.62,17.54 9.8,17.54 10.01,17.74 10.01,18.43 10.31,18.73 v11.48,18.73 | v14.66,19.01 19.61,19.01 20.45,18.17 23.01,18.17 v23.04,18.2
  pour Top (no thermals): 4.72,13.3 0,13.3 0,11.77 4.72,11.77
V_BOOSTED_4.2V  (2 unrouted)
V_REF  (3 unrouted)
  Bottom 0.152: R16.2 8.61,15.56 R8.2 | R18.2 8.81,7.89 8.48,7.56 7.24,7.56 7.09,7.71 6.58,7.71 R17.2
VCCA  (via drill 0.38)
  Top 0.152: U1.42 17.79,6.99 19.2,5.5 v19.2,3.62
  Bottom 0.152: v19.2,3.62 19.2,5.5 17.8,6.97 17.75,6.97 17.25,7.48 C14.1
VCCD  (via drill 0.38)
  Top 0.152: U1.26 v13.44,11.44 | v23.16,10.3 23.11,10.25 U1.57
  Bottom 0.152: v13.44,11.44 C40.1 15.46,11.13 16.15,10.43 21.29,10.43 21.46,10.25 23.11,10.25 v23.16,10.3
VSSBOOST  (1 unrouted)
YW_LED
  Top 0.152: U1.4 20.19,17.81 21.87,19.49 21.87,21.37 22.07,21.58 22.4,21.58 22.55,21.73 LED1.A

### Text on the board
tPlace: YW | RD | GN
bPlace: Andrew Pullin | Biomimetic | Millisystems | Laboratory | 2014.08.06 | PSOCProc 1.0 Rev A
tNames: A+ | A- | B- | B+ | BATT+ | BATT- | C+ | C- | D- | D+
bNames: AN1 | AN4/IC7 | AN5/IC8 | IC3/INT3 | AN3